# EasyEDA Pro project TeensySensorBoardV2.eprj, board PCB1
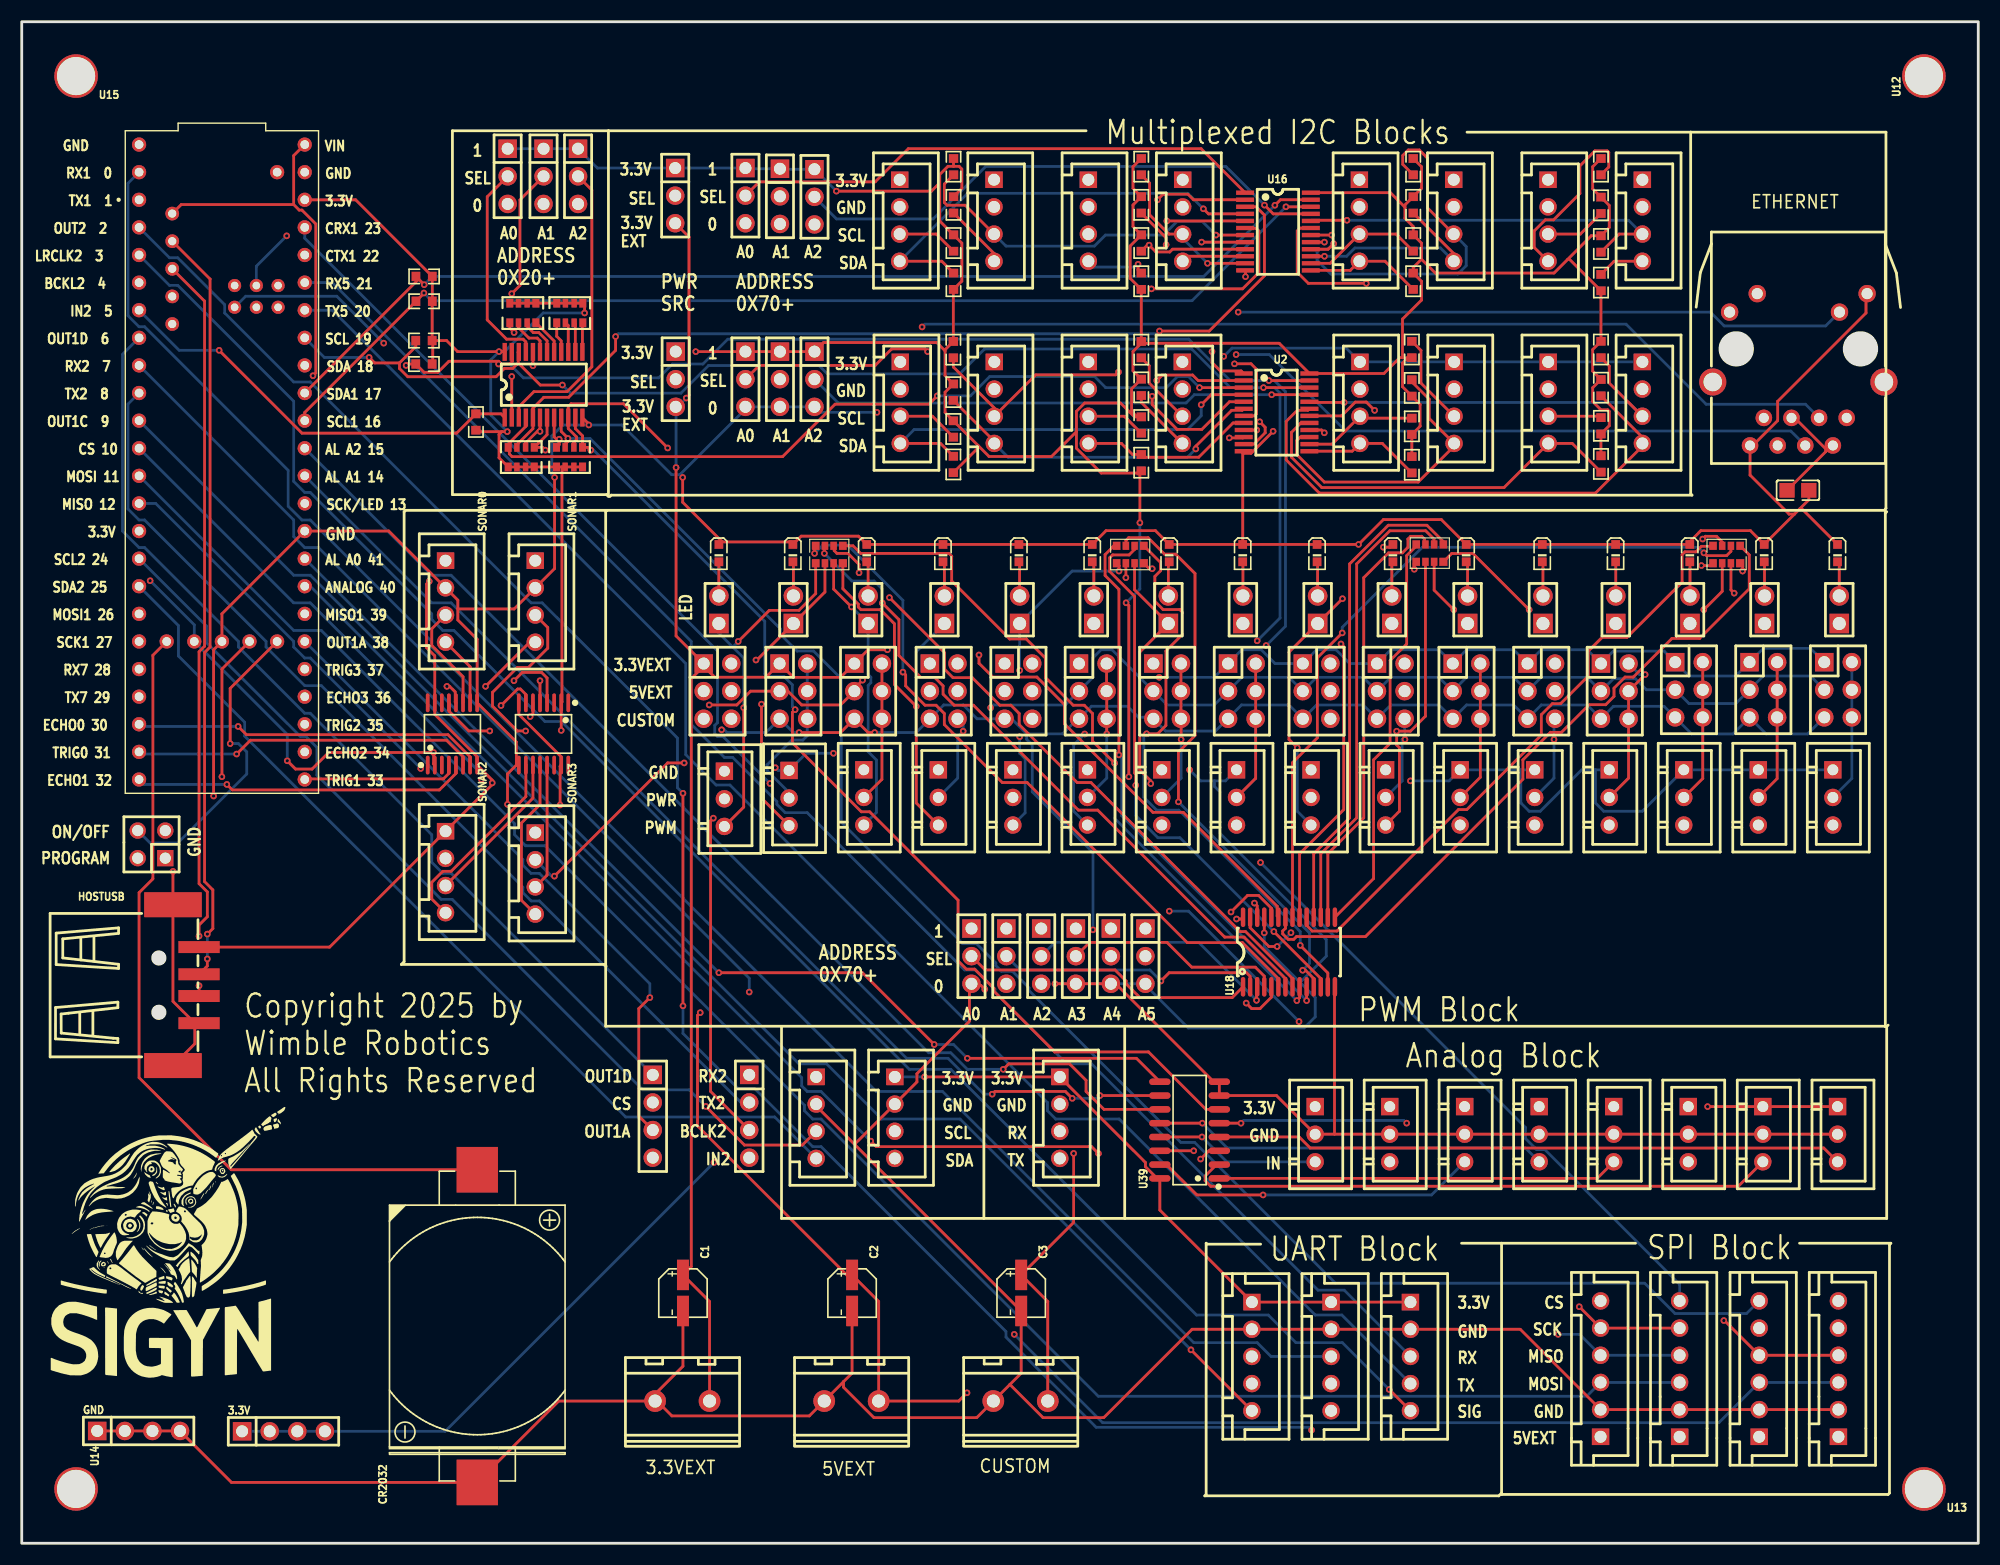
[diagram p8: board, top side]
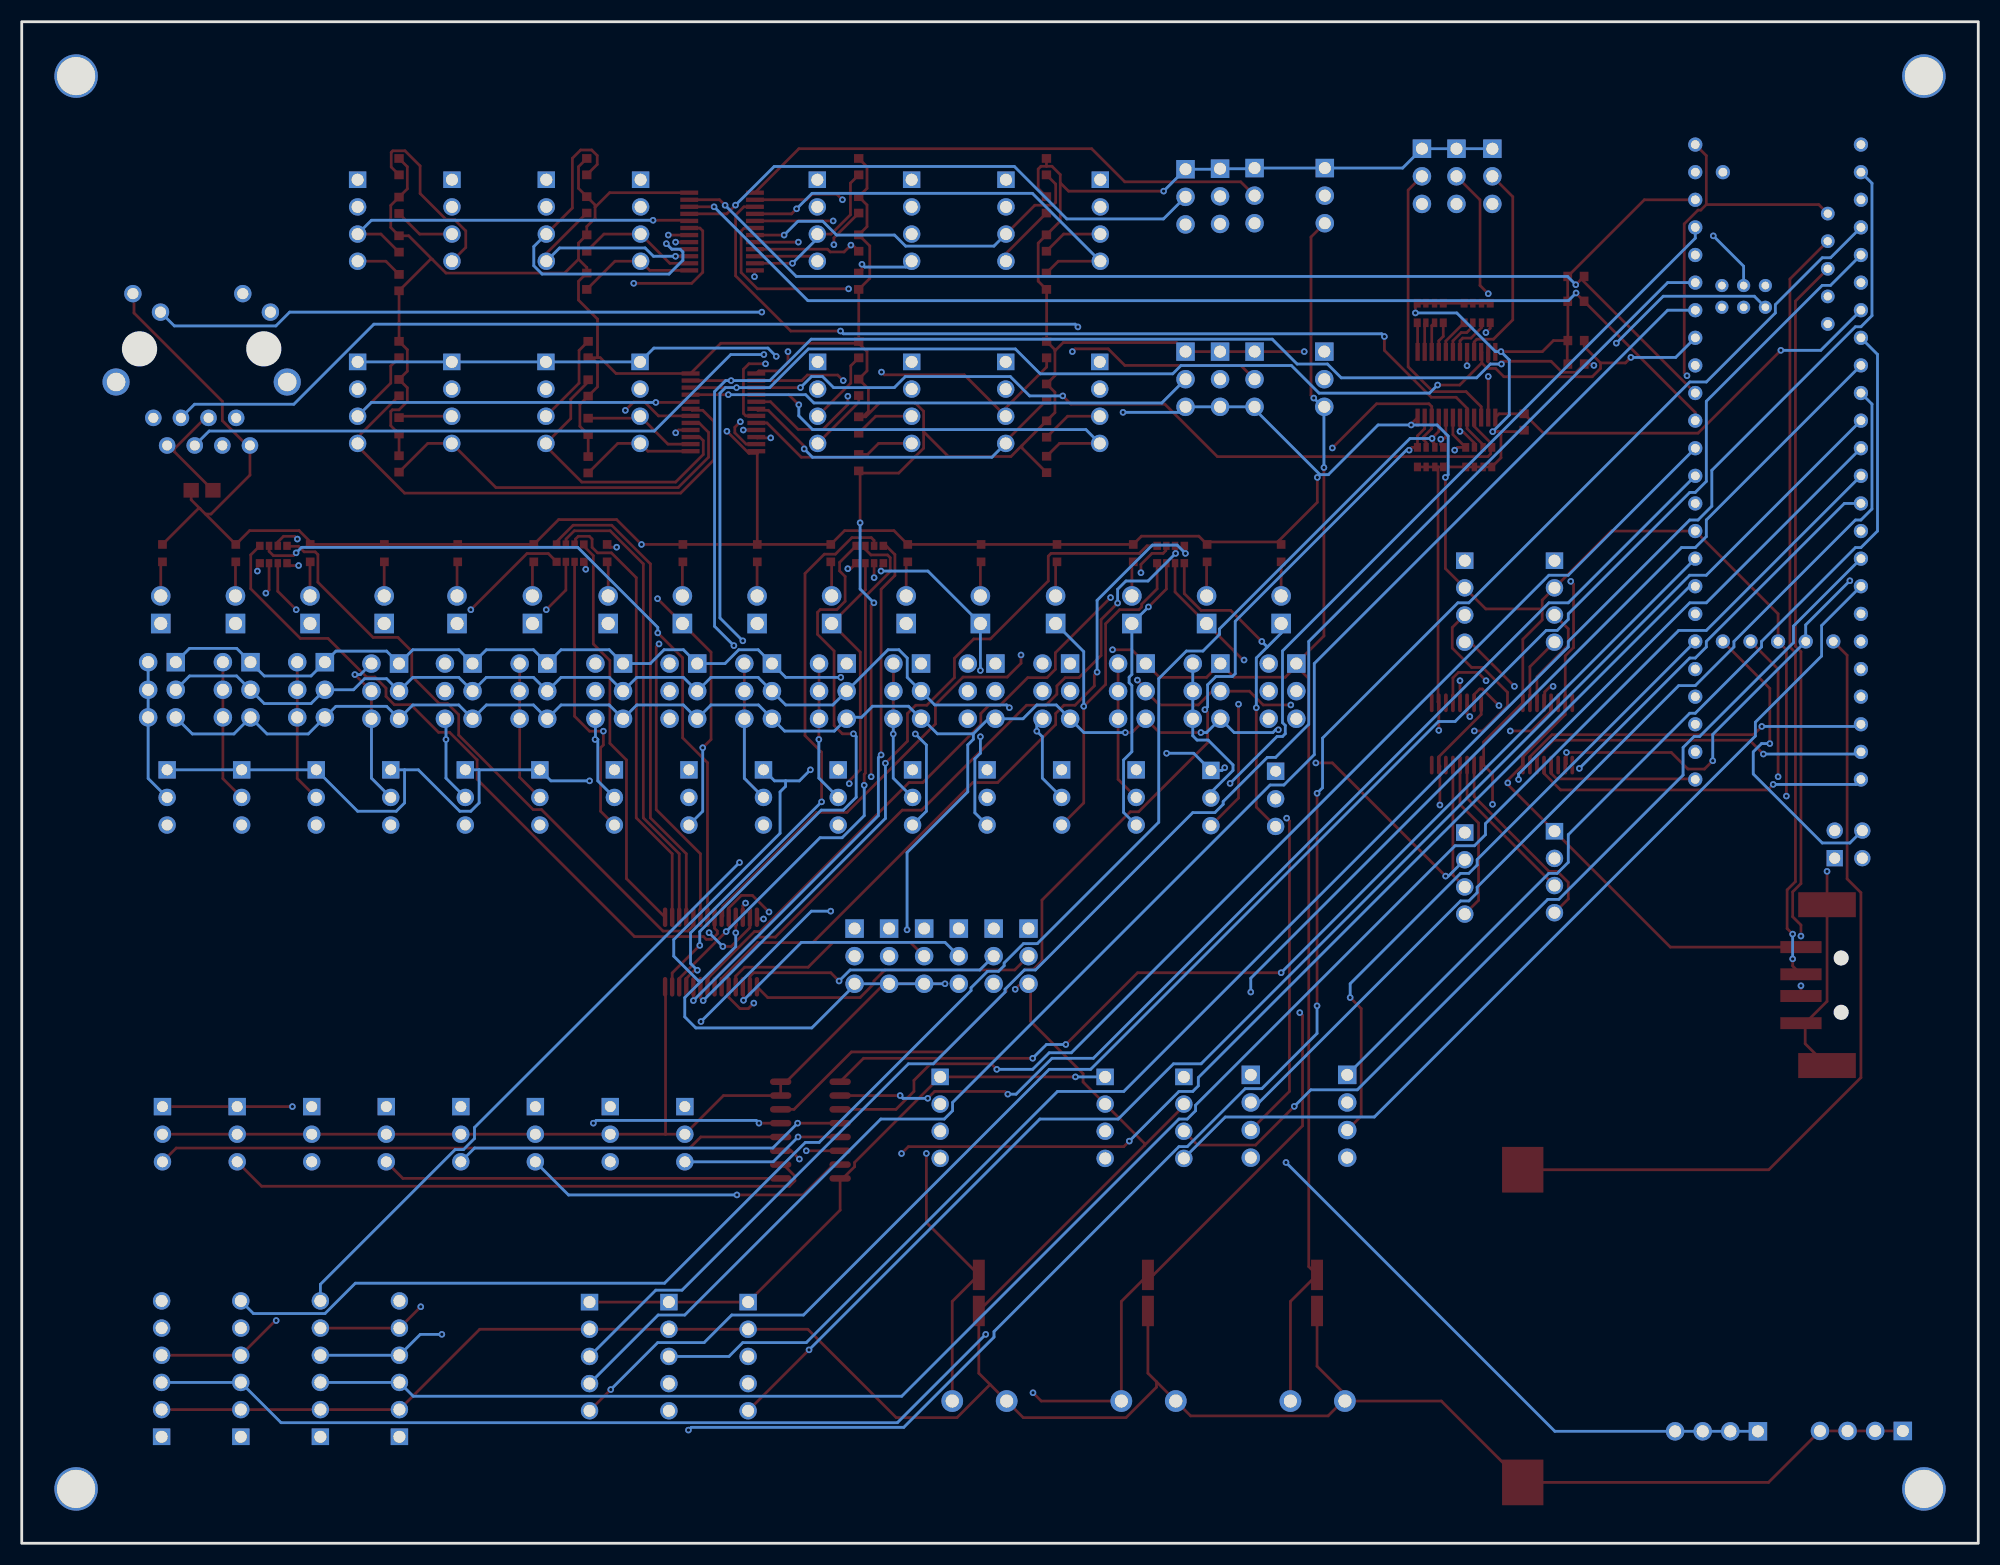
[diagram p9: board, bottom side, seen from below]

Outline 180 x 140 mm; copper layers: Top Layer, Inner1, Inner2, Bottom Layer. Coordinates in mm from the lower left corner of the outline.
Outline path: rectangle 0,140 180,0
Stack: Top Layer 0.035mm Outer layer thickness 1oz / Dielectric1 0.2104mm 7628 RC49% 8.6mil / Inner1 0.0152mm Inner layer thickness / Dielectric2 1.065mm 1.1mm H/HOZ Copper / Inner2 0.0152mm Inner layer thickness / Dielectric3 0.2104mm 7628 RC49% 8.6mil / Bottom Layer 0.035mm Outer layer thickness 1oz

## Design rules (mm)
template: Custom Config
spacing copperThickness1oz (default): track to track 0.102, other pairs 0.152 to 0.3
spacing copperThickness2oz: track to track 0.203, other pairs 0.152 to 0.3
track width copperThickness1oz (default): min 0.127, default 0.254, max 2.54
track width copperThickness2oz: min 0.203, default 0.254, max 2.54
track width trackWidth1: min 0.127, default 0.5, max 2.54
differential pair differentialPair (default): width min 0.127, default 0.254, max 2.54; gap min 0.152, default 0.152
via viaSize (default): diameter min 0.5, default 0.61, max 10; hole min 0.3, default 0.305, max 6.3
net class Power uses trackWidth1

## Placement (name value [footprint] x y rotation side)
3.3V  PZ254V-11-04P  [HDR-TH_4P-P2.54-V-M]  24.08 10.3 0 top
3.3VEXT  WJ127-5.0-2P  [CONN-TH_2P-P5.00_CPC3703CTR]  60.77 13.09 0 top
5VEXT  WJ127-5.0-2P  [CONN-TH_2P-P5.00_CPC3703CTR]  76.33 13.09 0 top
C1  10uF  [CAP-SMD_BD4.0-L4.3-W4.3-LS5.0-FD]  60.83 23.03 270 top
C2  10uF  [CAP-SMD_BD4.0-L4.3-W4.3-LS5.0-FD]  76.39 23.03 270 top
C3  10uF  [CAP-SMD_BD4.0-L4.3-W4.3-LS5.0-FD]  91.95 23.03 270 top
C4  100nF  [C0805]  163.41 96.89 0 top
CN10  ZX-XH2.54-4PZZ  [CONN-TH_4P-P2.50_4PIN]  95.5 39.16 270 top
CN11  ZX-XH2.54-4PZZ  [CONN-TH_4P-P2.50_4PIN]  73.09 39.16 270 top
CN12  ZX-XH2.54-4PZZ  [CONN-TH_4P-P2.50_4PIN]  80.32 39.16 270 top
CN14  ZX-XH2.54-4PZZ  [CONN-TH_4P-P2.50_4PIN]  80.82 104.95 270 top
CN15  ZX-XH2.54-4PZZ  [CONN-TH_4P-P2.50_4PIN]  89.47 104.95 270 top
CN16  ZX-XH2.54-4PZZ  [CONN-TH_4P-P2.50_4PIN]  98.12 104.95 270 top
CN17  ZX-XH2.54-4PZZ  [CONN-TH_4P-P2.50_4PIN]  106.78 104.95 270 top
CN18  ZX-XH2.54-4PZZ  [CONN-TH_4P-P2.50_4PIN]  123.11 104.95 270 top
CN19  ZX-XH2.54-4PZZ  [CONN-TH_4P-P2.50_4PIN]  131.78 104.95 270 top
CN20  ZX-XH2.54-4PZZ  [CONN-TH_4P-P2.50_4PIN]  140.44 104.95 270 top
CN21  ZX-XH2.54-4PZZ  [CONN-TH_4P-P2.50_4PIN]  149.1 104.95 270 top
CN56  ZX-XH2.54-3PZZ  [CONN-TH_3P-P2.54_2501S-3P]  167.05 37.64 270 top
CN57  ZX-XH2.54-3PZZ  [CONN-TH_3P-P2.54_2501S-3P]  160.18 37.64 270 top
CN58  ZX-XH2.54-3PZZ  [CONN-TH_3P-P2.54_2501S-3P]  153.32 37.64 270 top
CN59  ZX-XH2.54-3PZZ  [CONN-TH_3P-P2.54_2501S-3P]  146.46 37.64 270 top
CN60  ZX-XH2.54-3PZZ  [CONN-TH_3P-P2.54_2501S-3P]  139.6 37.64 270 top
CN61  ZX-XH2.54-3PZZ  [CONN-TH_3P-P2.54_2501S-3P]  132.75 37.64 270 top
CN62  ZX-XH2.54-3PZZ  [CONN-TH_3P-P2.54_2501S-3P]  125.86 37.64 270 top
CN63  ZX-XH2.54-3PZZ  [CONN-TH_3P-P2.54_2501S-3P]  118.99 37.64 270 top
CN64  ZX-XH2.54-4PZZ  [CONN-TH_4P-P2.50_4PIN]  80.77 121.71 270 top
CN65  ZX-XH2.54-4PZZ  [CONN-TH_4P-P2.50_4PIN]  89.45 121.71 270 top
CN66  ZX-XH2.54-4PZZ  [CONN-TH_4P-P2.50_4PIN]  98.13 121.71 270 top
CN67  ZX-XH2.54-4PZZ  [CONN-TH_4P-P2.50_4PIN]  106.81 121.71 270 top
CN68  ZX-XH2.54-4PZZ  [CONN-TH_4P-P2.50_4PIN]  123.06 121.71 270 top
CN69  ZX-XH2.54-4PZZ  [CONN-TH_4P-P2.50_4PIN]  131.74 121.71 270 top
CN70  ZX-XH2.54-4PZZ  [CONN-TH_4P-P2.50_4PIN]  140.42 121.71 270 top
CN71  ZX-XH2.54-4PZZ  [CONN-TH_4P-P2.50_4PIN]  149.1 121.71 270 top
CN72  ZX-XH2.54-3PZZ  [CONN-TH_3P-P2.54_2501S-3P]  64.64 68.5 270 top
CN73  ZX-XH2.54-3PZZ  [CONN-TH_3P-P2.54_2501S-3P]  70.6 68.57 270 top
CN74  ZX-XH2.54-3PZZ  [CONN-TH_3P-P2.54_2501S-3P]  77.47 68.63 270 top
CN75  ZX-XH2.54-3PZZ  [CONN-TH_3P-P2.54_2501S-3P]  84.33 68.63 270 top
CN76  ZX-XH2.54-3PZZ  [CONN-TH_3P-P2.54_2501S-3P]  91.19 68.63 270 top
CN77  ZX-XH2.54-3PZZ  [CONN-TH_3P-P2.54_2501S-3P]  98.04 68.63 270 top
CN78  ZX-XH2.54-3PZZ  [CONN-TH_3P-P2.54_2501S-3P]  104.89 68.63 270 top
CN79  ZX-XH2.54-3PZZ  [CONN-TH_3P-P2.54_2501S-3P]  111.76 68.63 270 top
CN80  ZX-XH2.54-3PZZ  [CONN-TH_3P-P2.54_2501S-3P]  118.62 68.63 270 top
CN81  ZX-XH2.54-3PZZ  [CONN-TH_3P-P2.54_2501S-3P]  125.48 68.63 270 top
CN82  ZX-XH2.54-3PZZ  [CONN-TH_3P-P2.54_2501S-3P]  132.33 68.63 270 top
CN83  ZX-XH2.54-3PZZ  [CONN-TH_3P-P2.54_2501S-3P]  139.19 68.63 270 top
CN84  ZX-XH2.54-3PZZ  [CONN-TH_3P-P2.54_2501S-3P]  146.05 68.63 270 top
CN85  ZX-XH2.54-3PZZ  [CONN-TH_3P-P2.54_2501S-3P]  152.91 68.63 270 top
CN86  ZX-XH2.54-3PZZ  [CONN-TH_3P-P2.54_2501S-3P]  159.77 68.63 270 top
CN87  ZX-XH2.54-3PZZ  [CONN-TH_3P-P2.54_2501S-3P]  166.62 68.63 270 top
CR2032  CR2032-BS-6  [BAT-TH_CR2032-BS-6-1]  41.91 19.99 90 top
CUSTOM  WJ127-5.0-2P  [CONN-TH_2P-P5.00_CPC3703CTR]  91.89 13.09 0 top
ETHERNET  J1B1211CCD  [RJ45-TH_J1B1211CCD]  163.45 108 180 top
F1  220Ω  [RES-ARRAY-SMD_0603-8P-L3.2-W1.6-TL]  74.29 90.98 90 top
F2  220Ω  [RES-ARRAY-SMD_0603-8P-L3.2-W1.6-TL]  101.98 90.98 90 top
F3  220Ω  [RES-ARRAY-SMD_0603-8P-L3.2-W1.6-TL]  129.54 91.11 90 top
F4  220Ω  [RES-ARRAY-SMD_0603-8P-L3.2-W1.6-TL]  156.84 90.98 90 top
GND  PZ254V-11-04P  [HDR-TH_4P-P2.54-V-M]  10.75 10.33 0 top
H2  PH-00013  [HDR-TH_2P-P2.54-V-M-R2-C1-S2.54]  70.99 85.9 0 top
H3  PH-00013  [HDR-TH_2P-P2.54-V-M-R2-C1-S2.54]  64.14 85.9 0 top
H4  PH-00013  [HDR-TH_2P-P2.54-V-M-R2-C1-S2.54]  77.87 85.9 0 top
H5  PH-00013  [HDR-TH_2P-P2.54-V-M-R2-C1-S2.54]  84.88 85.9 0 top
H6  PH-00013  [HDR-TH_2P-P2.54-V-M-R2-C1-S2.54]  91.81 85.9 0 top
H7  PH-00013  [HDR-TH_2P-P2.54-V-M-R2-C1-S2.54]  98.63 85.9 0 top
H8  PH-00013  [HDR-TH_2P-P2.54-V-M-R2-C1-S2.54]  105.49 85.9 0 top
H9  PH-00013  [HDR-TH_2P-P2.54-V-M-R2-C1-S2.54]  112.35 85.9 0 top
H10  PH-00013  [HDR-TH_2P-P2.54-V-M-R2-C1-S2.54]  119.22 85.9 0 top
H11  PH-00013  [HDR-TH_2P-P2.54-V-M-R2-C1-S2.54]  126.05 85.9 0 top
H12  PH-00013  [HDR-TH_2P-P2.54-V-M-R2-C1-S2.54]  133.02 85.9 0 top
H13  PH-00013  [HDR-TH_2P-P2.54-V-M-R2-C1-S2.54]  139.95 85.9 0 top
H14  PH-00013  [HDR-TH_2P-P2.54-V-M-R2-C1-S2.54]  146.65 85.9 0 top
H15  PH-00013  [HDR-TH_2P-P2.54-V-M-R2-C1-S2.54]  153.48 85.9 0 top
H16  PH-00013  [HDR-TH_2P-P2.54-V-M-R2-C1-S2.54]  160.34 85.9 0 top
H17  PH-00013  [HDR-TH_2P-P2.54-V-M-R2-C1-S2.54]  167.21 85.9 0 top
H18  HX PZ2.54-2x2P ZZ  [HDR-TH_HX-PZ2.54-2X2P-ZZ]  11.94 64.31 90 top
H19  PZ254V-11-04P  [HDR-TH_4P-P2.54-V-M]  66.93 39.29 270 top
H20  PZ254V-11-04P  [HDR-TH_4P-P2.54-V-M]  58.06 39.29 270 top
HOSTUSB  BX-TYPE-A-MWT4P  [USB-A-SMD_BX-TYPE-A-MWT4P]  15.11 51.35 270 top
I2C1-A0  PZ254V-11-03P  [HDR-TH_3P-P2.54-V-M]  66.58 107.11 270 top
I2C1-A1  PZ254V-11-03P  [HDR-TH_3P-P2.54-V-M]  69.75 107.11 270 top
I2C1-A2  PZ254V-11-03P  [HDR-TH_3P-P2.54-V-M]  72.93 107.11 270 top
I2C1-PWR  PZ254V-11-03P  [HDR-TH_3P-P2.54-V-M]  60.17 107.11 270 top
I2C2-A0  PZ254V-11-03P  [HDR-TH_3P-P2.54-V-M]  66.58 124 270 top
I2C2-A1  PZ254V-11-03P  [HDR-TH_3P-P2.54-V-M]  69.75 123.93 270 top
I2C2-A2  PZ254V-11-03P  [HDR-TH_3P-P2.54-V-M]  72.93 123.89 270 top
I2C2-PWR  PZ254V-11-03P  [HDR-TH_3P-P2.54-V-M]  60.12 124 270 top
I2CX-A0  PZ254V-11-03P  [HDR-TH_3P-P2.54-V-M]  44.7 125.78 270 top
I2CX-A1  PZ254V-11-03P  [HDR-TH_3P-P2.54-V-M]  48.01 125.78 270 top
I2CX-A2  PZ254V-11-03P  [HDR-TH_3P-P2.54-V-M]  51.18 125.78 270 top
LED1  19-219/GHC-YR2T1B5Y/3T  [LED-SMD_L1.6-W0.8_19-219-GHC-YR2T1B5Y-3T]  70.94 91.11 270 top
LED2  19-219/GHC-YR2T1B5Y/3T  [LED-SMD_L1.6-W0.8_19-219-GHC-YR2T1B5Y-3T]  64.14 91.11 270 top
LED3  19-219/GHC-YR2T1B5Y/3T  [LED-SMD_L1.6-W0.8_19-219-GHC-YR2T1B5Y-3T]  77.74 91.11 270 top
LED4  19-219/GHC-YR2T1B5Y/3T  [LED-SMD_L1.6-W0.8_19-219-GHC-YR2T1B5Y-3T]  84.76 91.11 270 top
LED5  19-219/GHC-YR2T1B5Y/3T  [LED-SMD_L1.6-W0.8_19-219-GHC-YR2T1B5Y-3T]  91.74 91.11 270 top
LED6  19-219/GHC-YR2T1B5Y/3T  [LED-SMD_L1.6-W0.8_19-219-GHC-YR2T1B5Y-3T]  98.49 91.11 270 top
LED7  19-219/GHC-YR2T1B5Y/3T  [LED-SMD_L1.6-W0.8_19-219-GHC-YR2T1B5Y-3T]  105.57 91.11 270 top
LED8  19-219/GHC-YR2T1B5Y/3T  [LED-SMD_L1.6-W0.8_19-219-GHC-YR2T1B5Y-3T]  112.33 91.11 270 top
LED9  19-219/GHC-YR2T1B5Y/3T  [LED-SMD_L1.6-W0.8_19-219-GHC-YR2T1B5Y-3T]  119.17 91.11 270 top
LED10  19-219/GHC-YR2T1B5Y/3T  [LED-SMD_L1.6-W0.8_19-219-GHC-YR2T1B5Y-3T]  126.14 91.11 270 top
LED11  19-219/GHC-YR2T1B5Y/3T  [LED-SMD_L1.6-W0.8_19-219-GHC-YR2T1B5Y-3T]  132.89 91.11 270 top
LED12  19-219/GHC-YR2T1B5Y/3T  [LED-SMD_L1.6-W0.8_19-219-GHC-YR2T1B5Y-3T]  139.89 91.11 270 top
LED13  19-219/GHC-YR2T1B5Y/3T  [LED-SMD_L1.6-W0.8_19-219-GHC-YR2T1B5Y-3T]  146.64 91.11 270 top
LED14  19-219/GHC-YR2T1B5Y/3T  [LED-SMD_L1.6-W0.8_19-219-GHC-YR2T1B5Y-3T]  153.46 91.11 270 top
LED15  19-219/GHC-YR2T1B5Y/3T  [LED-SMD_L1.6-W0.8_19-219-GHC-YR2T1B5Y-3T]  160.31 91.11 270 top
LED16  19-219/GHC-YR2T1B5Y/3T  [LED-SMD_L1.6-W0.8_19-219-GHC-YR2T1B5Y-3T]  167.05 91.11 270 top
PWM-A0  PZ254V-11-03P  [HDR-TH_3P-P2.54-V-M]  87.38 54.02 270 top
PWM-A1  PZ254V-11-03P  [HDR-TH_3P-P2.54-V-M]  90.58 54.02 270 top
PWM-A2  PZ254V-11-03P  [HDR-TH_3P-P2.54-V-M]  93.79 54.02 270 top
PWM-A3  PZ254V-11-03P  [HDR-TH_3P-P2.54-V-M]  96.98 54.02 270 top
PWM-A4  PZ254V-11-03P  [HDR-TH_3P-P2.54-V-M]  100.2 54.02 270 top
PWM-A5  PZ254V-11-03P  [HDR-TH_3P-P2.54-V-M]  103.38 54.02 270 top
R1  3kΩ  [R0603]  85.71 99.26 90 top
R2  3kΩ  [R0603]  85.71 102.53 270 top
R3  3kΩ  [R0603]  85.71 105.92 270 top
R4  3kΩ  [R0603]  85.71 109.83 270 top
R5  3kΩ  [R0603]  103 99.43 90 top
R6  3kΩ  [R0603]  103 102.89 270 top
R7  3kΩ  [R0603]  103 106.36 270 top
R8  3kΩ  [R0603]  103 109.83 270 top
R9  3kΩ  [R0603]  145.29 109.84 90 top
R10  3kΩ  [R0603]  145.29 106.33 90 top
R11  3kΩ  [R0603]  145.29 102.82 270 top
R12  3kΩ  [R0603]  145.29 99.31 90 top
R13  3kΩ  [R0603]  127.89 109.84 270 top
R14  3kΩ  [R0603]  127.89 106.31 270 top
R15  3kΩ  [R0603]  127.89 102.77 270 top
R16  3kΩ  [R0603]  127.89 99.24 90 top
R17  3kΩ  [R0603]  37 110.66 0 top
R18  3kΩ  [R0603]  37 108.5 0 top
R35  3kΩ  [R0603]  85.72 116.12 90 top
R36  3kΩ  [R0603]  85.72 119.64 270 top
R37  3kΩ  [R0603]  85.72 123.15 270 top
R38  3kΩ  [R0603]  85.72 126.66 270 top
R39  3kΩ  [R0603]  103 116.12 90 top
R40  3kΩ  [R0603]  103 119.64 270 top
R41  3kΩ  [R0603]  103 123.15 270 top
R42  3kΩ  [R0603]  145.29 119.55 90 top
R43  3kΩ  [R0603]  145.29 116 270 top
R44  3kΩ  [R0603]  145.29 123.11 90 top
R45  3kΩ  [R0603]  145.29 126.66 90 top
R46  3kΩ  [R0603]  128.02 126.66 90 top
R47  3kΩ  [R0603]  128.02 123.15 90 top
R48  3kΩ  [R0603]  128.02 119.64 90 top
R49  3kΩ  [R0603]  128.02 116.12 90 top
R50  3kΩ  [R0603]  103 126.66 270 top
R51  3kΩ  [R0603]  41.78 103.17 270 top
R52  3kΩ  [R0603]  37.02 114.28 0 top
R53  3kΩ  [R0603]  37.02 116.56 0 top
RN1  10kΩ  [RES-ARRAY-SMD_0603-8P-L3.2-W1.6-BL]  45.95 99.93 0 top
RN2  10kΩ  [RES-ARRAY-SMD_0603-8P-L3.2-W1.6-BL]  50.39 99.93 0 top
RN3  10kΩ  [RES-ARRAY-SMD_0603-8P-L3.2-W1.6-BL]  50.42 113.2 180 top
RN4  10kΩ  [RES-ARRAY-SMD_0603-8P-L3.2-W1.6-BL]  46.1 113.2 180 top
SONAR0  ZX-XH2.54-4PZZ  [CONN-TH_4P-P2.50_4PIN]  38.99 86.66 270 top
SONAR1  ZX-XH2.54-4PZZ  [CONN-TH_4P-P2.50_4PIN]  47.24 86.66 270 top
SONAR2  ZX-XH2.54-4PZZ  [CONN-TH_4P-P2.50_4PIN]  38.99 61.77 270 top
SONAR3  ZX-XH2.54-4PZZ  [CONN-TH_4P-P2.50_4PIN]  47.24 61.64 270 top
U2  TCA9548APWR  [TSSOP-24_L7.8-W4.4-P0.65-LS6.4-BL]  115.44 104.06 270 top
U4  ZX-XH2.54-6PZZ  [CONN-TH_6P-P2.50_ZX-XH2.54-6PZZ]  152.53 16.05 270 top
U5  ZX-XH2.54-5PZZ  [CONN-TH_5P-P2.50_ZX-XH2.54-5PZZ]  113.17 17.19 270 top
U6  ZX-XH2.54-5PZZ  [CONN-TH_5P-P2.50_ZX-XH2.54-5PZZ]  120.46 17.19 270 top
U8  ZX-XH2.54-6PZZ  [CONN-TH_6P-P2.50_ZX-XH2.54-6PZZ]  145.25 16.05 270 top
U12  -  [3.5mm_Hole]  175 135 90 top
U13  -  [3.5mm_Hole]  175 5 180 top
U14  -  [3.5mm_Hole]  5 5 270 top
U15  -  [3.5mm_Hole]  5 135 180 top
U16  TCA9548APWR  [TSSOP-24_L7.8-W4.4-P0.65-LS6.4-BL]  115.57 120.7 270 top
U17  TCA9535PWR  [TSSOP-24_L7.8-W4.4-P0.65-LS6.4-BL]  48.01 106.6 0 top
U18  PCA9685PW,118  [TSSOP-28_L9.7-W4.4-P0.65-LS6.4-TL]  116.59 54.4 90 top
U19  BX-PZ2.54-2-3PZZ  [HDR-TH_6P-P2.54-V-M-R2-C3-S2.54]  64.01 78.41 270 top
U20  BX-PZ2.54-2-3PZZ  [HDR-TH_6P-P2.54-V-M-R2-C3-S2.54]  70.99 78.41 270 top
U21  BX-PZ2.54-2-3PZZ  [HDR-TH_6P-P2.54-V-M-R2-C3-S2.54]  77.87 78.41 270 top
U22  BX-PZ2.54-2-3PZZ  [HDR-TH_6P-P2.54-V-M-R2-C3-S2.54]  84.82 78.41 270 top
U23  BX-PZ2.54-2-3PZZ  [HDR-TH_6P-P2.54-V-M-R2-C3-S2.54]  91.69 78.41 270 top
U24  BX-PZ2.54-2-3PZZ  [HDR-TH_6P-P2.54-V-M-R2-C3-S2.54]  98.54 78.41 270 top
U25  BX-PZ2.54-2-3PZZ  [HDR-TH_6P-P2.54-V-M-R2-C3-S2.54]  105.38 78.41 270 top
U26  BX-PZ2.54-2-3PZZ  [HDR-TH_6P-P2.54-V-M-R2-C3-S2.54]  112.25 78.41 270 top
U27  BX-PZ2.54-2-3PZZ  [HDR-TH_6P-P2.54-V-M-R2-C3-S2.54]  119.13 78.41 270 top
U28  BX-PZ2.54-2-3PZZ  [HDR-TH_6P-P2.54-V-M-R2-C3-S2.54]  125.95 78.41 270 top
U29  BX-PZ2.54-2-3PZZ  [HDR-TH_6P-P2.54-V-M-R2-C3-S2.54]  132.92 78.41 270 top
U30  BX-PZ2.54-2-3PZZ  [HDR-TH_6P-P2.54-V-M-R2-C3-S2.54]  139.79 78.41 270 top
U31  BX-PZ2.54-2-3PZZ  [HDR-TH_6P-P2.54-V-M-R2-C3-S2.54]  146.56 78.41 270 top
U32  BX-PZ2.54-2-3PZZ  [HDR-TH_6P-P2.54-V-M-R2-C3-S2.54]  153.38 78.53 270 top
U33  BX-PZ2.54-2-3PZZ  [HDR-TH_6P-P2.54-V-M-R2-C3-S2.54]  160.23 78.53 270 top
U34  BX-PZ2.54-2-3PZZ  [HDR-TH_6P-P2.54-V-M-R2-C3-S2.54]  167.1 78.53 270 top
U35  TXB0106PWR  [TSSOP-16_L5.0-W4.4-P0.65-LS6.4-BL]  39.62 74.47 0 top
U36  TXB0106PWR  [TSSOP-16_L5.0-W4.4-P0.65-LS6.4-BL]  48.01 74.47 180 top
U37  Teensy 4.1  [MODULE_DEV-16771]  18.42 99.49 270 top
U39  CD74HC4051M96  [SOIC-16_L9.9-W3.9-P1.27-LS6.0-BL]  107.44 38.02 90 top
U40  ZX-XH2.54-6PZZ  [CONN-TH_6P-P2.50_ZX-XH2.54-6PZZ]  167.13 16.05 270 top
U41  ZX-XH2.54-6PZZ  [CONN-TH_6P-P2.50_ZX-XH2.54-6PZZ]  159.84 16.05 270 top
U42  ZX-XH2.54-5PZZ  [CONN-TH_5P-P2.50_ZX-XH2.54-5PZZ]  127.76 17.19 270 top

## Footprints (pads in the part's own frame, mm; a bottom-side part is the same pattern mirrored in y, then rotated)
3.5mm_Hole
  round 4 hole 3.5: 3(0,0)
BAT-TH_CR2032-BS-6-1
  rect 4.2x3.8 smd: 1(14.385,0) 2(-14.385,0)
C0805
  rect 1.41x1.35 smd: 1(-1,0) 2(1,0)
CAP-SMD_BD4.0-L4.3-W4.3-LS5.0-FD
  rect 2.8x1.1 smd: 1(-1.661,0) 2(1.661,0)
CONN-TH_2P-P5.00_CPC3703CTR
  round 2 hole 1.2: 1(-2.505,0) 2(2.505,0)
CONN-TH_3P-P2.54_2501S-3P
  rect 1.6x1.6 hole 1: 1(-2.54,0)
  round 1.6 hole 1: 2(0,0) 3(2.54,0)
CONN-TH_4P-P2.50_4PIN
  rect 1.524x1.6 hole 1.1: 1(-3.75,0)
  round 1.6 hole 1.1: 2(-1.25,0) 3(1.25,0) 4(3.75,0)
CONN-TH_5P-P2.50_ZX-XH2.54-5PZZ
  rect 1.524x1.6 hole 1.1: 1(-5,0)
  round 1.6 hole 1.1: 2(-2.5,0) 3(0,0) 4(2.5,0) 5(5,0)
CONN-TH_6P-P2.50_ZX-XH2.54-6PZZ
  rect 1.524x1.6 hole 1.1: 1(6.25,0)
  round 1.6 hole 1.1: 2(3.75,0) 3(1.25,0) 4(-1.25,0) 5(-3.75,0) 6(-6.25,0)
HDR-TH_2P-P2.54-V-M-R2-C1-S2.54
  rect 1.8x1.8 hole 1.2: 1(0,-1.27)
  round 1.8 hole 1.2: 2(0,1.27)
HDR-TH_3P-P2.54-V-M
  rect 1.7x1.7 hole 1.1: 1(-2.54,0)
  round 1.7 hole 1.1: 2(0,0) 3(2.54,0)
HDR-TH_4P-P2.54-V-M
  rect 1.7x1.7 hole 1.1: 1(-3.81,0)
  round 1.7 hole 1.1: 2(-1.27,0) 3(1.27,0) 4(3.81,0)
HDR-TH_6P-P2.54-V-M-R2-C3-S2.54
  rect 1.7x1.7 hole 1.1: 1(-2.54,-1.27)
  round 1.7 hole 1.1: 2(-2.54,1.27) 3(0,-1.27) 4(0,1.27) 5(2.54,-1.27) 6(2.54,1.27)
HDR-TH_HX-PZ2.54-2X2P-ZZ
  rect 1.5x1.5 hole 1.02: 1(-1.27,-1.27)
  round 1.5 hole 1.02: 2(-1.27,1.27) 3(1.27,-1.27) 4(1.27,1.27)
LED-SMD_L1.6-W0.8_19-219-GHC-YR2T1B5Y-3T
  rect 0.8x0.8 smd: 1(0.799,0) 2(-0.799,0)
MODULE_DEV-16771
  round 1.308 hole 0.8: 0(-26.67,-7.62) 1(-24.13,-7.62) 2(-21.59,-7.62) 3(-19.05,-7.62) 3.3V_1(6.35,-7.62) 3.3V_2(-24.13,7.62) 3.3V_3(16.51,-2.54) 4(-16.51,-7.62) 5(-13.97,-7.62) 6(-11.43,-7.62) 7(-8.89,-7.62) 8(-6.35,-7.62) 9(-3.81,-7.62) 10(-1.27,-7.62) 11(1.27,-7.62) 12(3.81,-7.62) 13(3.81,7.62) 14(1.27,7.62) 15(-1.27,7.62) 16(-3.81,7.62) 17(-6.35,7.62) 18(-8.89,7.62) 19(-11.43,7.62) 20(-13.97,7.62) 21(-16.51,7.62) 22(-19.05,7.62) 23(-21.59,7.62) 24(8.89,-7.62) 25(11.43,-7.62) 26(13.97,-7.62) 27(16.51,-7.62) 28(19.05,-7.62) 29(21.59,-7.62) 30(24.13,-7.62) 31(26.67,-7.62) 32(29.21,-7.62) 33(29.21,7.62) 34(26.67,7.62) 35(24.13,7.62) 36(21.59,7.62) 37(19.05,7.62) 38(16.51,7.62) 39(13.97,7.62) 40(11.43,7.62) 41(8.89,7.62) GND1(-29.21,-7.62) GND2(6.35,7.62) GND3(-26.67,7.62) GND4(16.51,0) ON/OFF(16.51,5.08) PROGRAM(16.51,2.54) VBAT(16.51,-5.08) VIN(-29.21,7.62) VUSB(-26.67,5.08)
  round 1.258 hole 0.75: 5V(-22.86,-4.57) D+(-17.78,-4.57) D-(-20.32,-4.57) USB_GND1(-15.24,-4.57) USB_GND2(-12.7,-4.57)
  round 1.208 hole 0.7: GND5(-14.24,3.17) LED(-16.24,3.17) R+(-16.24,5.17) R-(-14.24,5.17) T+(-14.24,1.17) T-(-16.24,1.17)
R0603
  rect 0.806x0.864 smd: 1(-0.753,0) 2(0.753,0)
RES-ARRAY-SMD_0603-8P-L3.2-W1.6-BL
  rect 0.65x0.8 smd: 1(-1.2,-0.9) 4(1.2,-0.9) 5(1.2,0.9) 8(-1.2,0.9)
  rect 0.5x0.8 smd: 2(-0.4,-0.9) 3(0.4,-0.9) 6(0.4,0.9) 7(-0.4,0.9)
RES-ARRAY-SMD_0603-8P-L3.2-W1.6-TL
  rect 0.75x0.7 smd: 1(-0.8,1.25) 5(0.8,-1.25) 8(0.8,1.25)
  rect 0.75x0.6 smd: 2(-0.8,0.4) 3(-0.8,-0.4) 6(0.8,-0.4) 7(0.8,0.4)
  rect 0.75x0.75 smd: 4(-0.8,-1.25)
RJ45-TH_J1B1211CCD
  round 1.524 hole 0.914: 1(-4.445,4.445) 2(-3.175,6.985) 3(-1.905,4.445) 4(-0.635,6.985) 5(0.635,4.445) 6(1.905,6.985) 7(3.175,4.445) 8(4.445,6.985)
  round 1.6 hole 1.02: 9(-6.325,-6.985) 10(-3.785,-5.285) 11(3.785,-6.985) 12(6.325,-5.285)
  round 2.5 hole 1.7: 13(-7.875,1.145) 14(7.875,1.145)
SOIC-16_L9.9-W3.9-P1.27-LS6.0-BL
  oval 0.602x1.971 smd: 1(-4.445,-2.736) 2(-3.175,-2.736) 3(-1.905,-2.736) 4(-0.635,-2.736) 5(0.635,-2.736) 6(1.905,-2.736) 7(3.175,-2.736) 8(4.445,-2.736) 9(4.445,2.736) 10(3.175,2.736) 11(1.905,2.736) 12(0.635,2.736) 13(-0.635,2.736) 14(-1.905,2.736) 15(-3.175,2.736) 16(-4.445,2.736)
TSSOP-16_L5.0-W4.4-P0.65-LS6.4-BL
  oval 0.343x1.732 smd: 1(-2.275,-2.866) 2(-1.625,-2.866) 3(-0.975,-2.866) 4(-0.325,-2.866) 5(0.325,-2.866) 6(0.975,-2.866) 7(1.625,-2.866) 8(2.275,-2.866) 9(2.275,2.866) 10(1.625,2.866) 11(0.975,2.866) 12(0.325,2.866) 13(-0.325,2.866) 14(-0.975,2.866) 15(-1.625,2.866) 16(-2.275,2.866)
TSSOP-24_L7.8-W4.4-P0.65-LS6.4-BL
  rect 0.4x1.65 smd: 1(-3.575,-3.022) 2(-2.925,-3.022) 3(-2.275,-3.022) 4(-1.625,-3.022) 5(-0.975,-3.022) 6(-0.325,-3.022) 7(0.325,-3.022) 8(0.975,-3.022) 9(1.625,-3.022) 10(2.275,-3.022) 11(2.925,-3.022) 12(3.575,-3.022) 13(3.575,3.022) 14(2.925,3.022) 15(2.275,3.022) 16(1.625,3.022) 17(0.975,3.022) 18(0.325,3.022) 19(-0.325,3.022) 20(-0.975,3.022) 21(-1.625,3.022) 22(-2.275,3.022) 23(-2.925,3.022) 24(-3.575,3.022)
TSSOP-28_L9.7-W4.4-P0.65-LS6.4-TL
  oval 1.804x0.406 smd: 1(-3.2,4.225) 2(-3.2,3.575) 3(-3.2,2.925) 4(-3.2,2.275) 5(-3.2,1.625) 6(-3.2,0.975) 7(-3.2,0.325) 8(-3.2,-0.325) 9(-3.2,-0.975) 10(-3.2,-1.625) 11(-3.2,-2.275) 12(-3.2,-2.925) 13(-3.2,-3.575) 14(-3.2,-4.225) 15(3.2,-4.225) 16(3.2,-3.575) 17(3.2,-2.925) 18(3.2,-2.275) 19(3.2,-1.625) 20(3.2,-0.975) 21(3.2,-0.325) 22(3.2,0.325) 23(3.2,0.975) 24(3.2,1.625) 25(3.2,2.275) 26(3.2,2.925) 27(3.2,3.575) 28(3.2,4.225)
USB-A-SMD_BX-TYPE-A-MWT4P
  rect 1.1x3.8 smd: 1(-3.5,1.2) 2(-1,1.2) 3(1,1.2) 4(3.5,1.2)
  rect 2.3x5.3 smd: 5(-7.4,-1.2) 6(7.4,-1.2)

## Nets
As in the schematic, except:
3.3V: 3.3V.1 3.3V.2 3.3V.3 3.3V.4 CN10.1 CN11.1 CN12.1 CN56.1 CN57.1 CN58.1 CN59.1 CN60.1 CN61.1 CN62.1 CN63.1 I2C1-A0.1 I2C1-A1.1 I2C1-A2.1 I2C1-PWR.1 I2C2-A0.1 I2C2-A1.1 I2C2-A2.1 I2C2-PWR.1 I2CX-A0.1 I2CX-A1.1 I2CX-A2.1 PWM-A0.1 PWM-A1.1 PWM-A2.1 PWM-A3.1 PWM-A4.1 PWM-A5.1 R1.1 R2.1 R3.1 R4.1 R5.1 R6.1 R7.1 R8.1 R9.2 R10.2 R11.2 R12.2 R13.2 R14.2 R15.2 R16.2 R17.2 R18.2 R35.1 R36.1 R37.1 R38.1 R39.1 R40.1 R41.1 R42.2 R43.2 R44.2 R45.2 R46.2 R47.2 R48.2 R49.2 R50.1 R51.2 R52.2 R53.2 RN1.1 RN1.2 RN1.3 RN1.4 RN2.1 RN2.2 RN2.3 RN2.4 RN3.1 RN3.2 RN3.3 RN3.4 RN4.1 RN4.2 RN4.3 RN4.4 U2.24 U5.1 U6.1 U16.24 U17.24 U18.28 U35.2 U36.2 U37.3.3V_1 U37.3.3V_2 U37.3.3V_3 U39.16 U42.1
5VEXT: 5VEXT.2 C2.1 HOSTUSB.1 SONAR0.1 SONAR1.1 SONAR2.1 SONAR3.1 U4.1 U8.1 U19.3 U20.3 U21.3 U22.3 U23.3 U24.3 U25.3 U26.3 U27.3 U28.3 U29.3 U30.3 U31.3 U32.3 U33.3 U34.3 U35.8 U35.15 U36.8 U36.15 U37.5V U37.VIN U40.1 U41.1
GND: 3.3VEXT.1 5VEXT.1 C1.2 C2.2 C3.2 C4.2 CN10.2 CN11.2 CN12.2 CN14.2 CN15.2 CN16.2 CN17.2 CN18.2 CN19.2 CN20.2 CN21.2 CN56.2 CN57.2 CN58.2 CN59.2 CN60.2 CN61.2 CN62.2 CN63.2 CN64.2 CN65.2 CN66.2 CN67.2 CN68.2 CN69.2 CN70.2 CN71.2 CN72.1 CN73.1 CN74.1 CN75.1 CN76.1 CN77.1 CN78.1 CN79.1 CN80.1 CN81.1 CN82.1 CN83.1 CN84.1 CN85.1 CN86.1 CN87.1 CR2032.2 CUSTOM.1 ETHERNET.8 ETHERNET.9 GND.1 GND.2 GND.3 GND.4 H18.1 H18.3 HOSTUSB.4 HOSTUSB.5 HOSTUSB.6 I2C1-A0.3 I2C1-A1.3 I2C1-A2.3 I2C2-A0.3 I2C2-A1.3 I2C2-A2.3 I2CX-A0.3 I2CX-A1.3 I2CX-A2.3 LED1.2 LED2.2 LED3.2 LED4.2 LED5.2 LED6.2 LED7.2 LED8.2 LED9.2 LED10.2 LED11.2 LED12.2 LED13.2 LED14.2 LED15.2 LED16.2 PWM-A0.3 PWM-A1.3 PWM-A2.3 PWM-A3.3 PWM-A4.3 PWM-A5.3 SONAR0.2 SONAR1.2 SONAR2.2 SONAR3.2 U2.12 U4.2 U5.2 U6.2 U8.2 U16.12 U17.12 U18.14 U18.25 U35.9 U36.9 U37.GND1 U37.GND2 U37.GND3 U37.GND4 U37.GND5 U37.USB_GND1 U37.USB_GND2 U39.7 U39.8 U40.2 U41.2 U42.2

Pads without a net: ETHERNET 7 11 12 13 14; H19 4; H20 4; U12 3; U13 3; U14 3; U15 3; U35 1 3 14 16; U36 1 3 14 16; U37 VUSB

## Via types
v1: diameter 0.61, hole 0.305, Top Layer to Bottom Layer, 229 vias

## Routing (per net, layer and track width the routed paths; a pad name or vN(x,y) marks a point on that pad's centre or on a via; arc(x,y) is an arc through that point)
3.3V: length 727.2
  Top Layer w0.254: 97.03,102.28 94.74,100 88.99,100 87.98,101.01 ; 97.03,102.28 97.03,104.16 97.79,104.92 101.09,104.92 102.36,103.65 102.62,103.65 ; 97.03,102.28 97.03,100.76 99.31,98.47 102.87,98.47 ; 44.9,114.1 51.62,114.1 51.78,113.94 v1(51.78,113.2) ; R50.1 102.24,126.66 102.24,124.67 R41.1 102.24,123.14 102.24,121.15 R40.1 101.98,119.38 101.98,116.39 R39.1 R8.1 103,110.42 ; 128.78,118.15 130.05,116.88 140.97,116.88 142.24,118.15 ; 128.78,118.15 128.02,117.39 R49.2 128.78,116.12 128.78,114.39 127.03,112.64 127.03,109.09 ; 128.78,118.15 128.78,119.63 R48.2 128.02,121.15 127.25,121.91 127.25,122.93 ; R37.1 86.49,124.67 86.49,126.44 86.23,126.7 85.72,126.7 ; 37.81,110.66 39.08,110.66 40.1,109.65 v1(43.91,109.65) 44.41,109.65 U17.24 ; 37.81,110.66 R17.2 37.76,114.26 R52.2 R53.2 30.72,123.62 U37.3.3V_2 ; 37.81,110.66 37.81,108.56 R18.2 ; 142.24,118.15 142.38,118.15 R43.2 R9.2 144.53,109.83 144.53,107.85 R10.2 144.53,106.32 144.53,105.05 145.29,104.29 145.9,104.29 146.05,104.14 146.05,102.83 R11.2 R12.2 ; 142.24,118.15 144.4,120.31 R42.2 146.05,121.07 146.05,123.1 R44.2 144.53,124.62 144.53,126.66 R45.2 ; 49.7,99.03 RN2.1 RN1.4 RN1.3 RN1.2 RN1.1 43.91,99.88 43.91,102.03 44.16,102.28 ; 49.7,99.03 49.7,77.41 U36.2 v1(49.63,74.79) ; 49.7,99.03 RN2.2 RN2.3 RN2.4 ; 103,110.42 115.68,110.42 U2.24 125.32,107.63 126.78,109.09 127.03,109.09 ; 103,110.42 102.24,109.65 102.24,107.88 R7.1 102.11,106.22 102.11,104.16 102.62,103.65 ; v1(101.85,70.53) 101.85,86.28 v1(101.6,86.53) ; 127.54,109.09 127.03,108.58 127.03,106.41 R14.2 128.65,104.79 128.65,102.78 R15.2 R16.2 ; 127.54,109.09 127.03,109.09 ; 127.54,109.09 R13.2 ; 102.62,103.65 R6.1 ; v1(24.43,72) 25.19,71.24 26.71,71.24 28.24,72.76 v1(37.89,72.76) 37.89,71.71 U35.2 ; U42.1 U6.1 U5.1 104.71,30.66 U39.16 104.45,33.57 103.38,34.65 103.38,35.04 CN10.1 v1(83.06,42.91) ; 85.72,126.7 85.22,126.7 84.46,125.94 84.46,125.17 ; 85.72,126.7 R38.1 ; 84.95,109.72 84.95,109.82 R4.1 85.71,115.35 R35.1 86.49,116.13 86.49,119.63 R36.1 84.46,121.66 84.46,125.17 ; 84.95,109.72 84.95,107.43 R3.1 84.95,105.91 84.95,104.04 R2.1 87.98,101.01 ; 84.95,109.72 84.18,110.48 73.77,110.48 I2C1-A2.1 I2C1-A1.1 I2C1-A0.1 v1(62.01,109.65) ; R46.2 128.78,126.66 128.78,124.67 R47.2 127.25,123.14 127.25,122.93 ; 103,98.67 102.87,98.55 102.87,98.47 ; v1(155.1,40.18) CN57.1 CN56.1 ; 87.98,101.01 87.98,100.78 R1.1 ; 84.46,125.17 83.69,124.41 v1(74.95,124.41) ; v1(111.76,57.44) 112.2,57.44 112.36,57.6 ; 102.87,98.47 v1(102.87,93.9) ; 127.25,122.93 125.91,124.27 U16.24 ; 44.16,102.28 v1(44.67,102.28) ; 44.16,102.28 41.92,102.28 R51.2
  Inner2 w0.254: v1(155.1,40.18) CN58.1 CN59.1 CN60.1 CN61.1 CN62.1 125.86,40.55 117.6,48.81 116.84,48.81 ; 116.84,48.81 116.84,49.57 111.76,54.65 v1(111.76,57.44) 112.01,57.69 112.01,58.2 111.51,58.71 107.31,58.71 106.68,58.08 ; 116.84,48.81 116.84,42.33 CN63.1 ; 95.75,54.6 PWM-A2.1 PWM-A1.1 PWM-A0.1 ; 106.68,58.08 101.85,62.91 v1(101.85,70.53) ; 106.68,58.08 105.16,56.56 PWM-A5.1 PWM-A4.1 99.69,57.07 97.49,57.07 PWM-A3.1 95.76,55.34 95.76,43.17 CN10.1 ; U37.3.3V_1 11.81,92.12 v1(11.81,88.56) ; v1(63.69,35.04) 65.47,36.82 67.5,36.82 73.09,42.4 CN11.1 CN12.1 v1(83.06,42.91) ; v1(62.01,109.65) I2C1-PWR.1 56.61,113.2 v1(51.78,113.2) ; v1(37.89,72.76) 38.4,72.25 47.09,72.25 v1(49.63,74.79)
  Bottom Layer w0.254: v1(24.43,72) 24.43,74.43 U37.3.3V_3 15.88,84.5 v1(11.81,88.56) ; v1(51.78,113.2) 47.97,113.2 44.42,109.65 v1(43.91,109.65) 43.15,108.89 43.15,103.81 v1(44.67,102.28) ; 3.3V.1 3.3V.2 3.3V.3 3.3V.4 38.95,10.3 v1(63.69,35.04) ; I2CX-A0.1 I2CX-A1.1 I2CX-A2.1 52.96,126.54 I2C2-PWR.1 I2C2-A0.1 66.64,126.47 I2C2-A1.1 69.8,126.43 I2C2-A2.1 v1(74.95,124.41) ; v1(102.87,93.9) 102.87,87.8 v1(101.6,86.53) ; v1(83.06,42.91) CN12.1
3.3VEXT: length 241.9
  Top Layer w0.254: 62.74,80.7 63.75,79.68 68.46,79.68 69.72,80.94 70.99,79.67 75.33,79.67 77.87,82.22 v1(79.65,82.22) ; 62.74,80.7 62.74,80.94 60.2,83.48 v1(60.2,98.98) ; 62.74,80.7 61.59,79.56 61.59,25.46 C1.1 63.28,22.25 3.3VEXT.2 ; v1(61.14,105.38) 61.39,105.63 61.39,120.19 I2C2-PWR.3
  Inner2 w0.254: 103.89,79.93 102.87,78.91 102.87,76.63 100.08,73.83 97.54,73.83 96.01,75.36 96.01,80.94 ; 103.89,79.93 103.89,80.72 104.11,80.94 ; 103.89,79.93 104.39,79.93 v1(104.65,79.67) ; 96.01,80.94 97.27,80.94 ; 96.01,80.94 94.74,80.94 93.47,82.22 91.69,82.22 90.42,80.94 87.87,80.94 86.6,82.22 84.82,82.22 83.55,80.94 82.28,82.22 v1(79.65,82.22)
  Bottom Layer w0.254: v1(61.14,105.38) 60.33,104.57 I2C1-PWR.3 60.2,104.53 v1(60.2,98.98) ; v1(104.65,79.67) 109.71,79.67 112.25,82.22 114.03,82.22 115.3,80.94 117.86,80.94 119.13,82.22 120.9,82.22 122.17,80.94 124.68,80.94 125.95,82.22 130.38,82.22 131.65,80.94 132.92,82.22 137.25,82.22 138.53,80.94 139.79,82.22 144.02,82.22 145.29,80.94 146.43,82.09 151.1,82.09 U32.1 153.38,79.8 157.69,79.8 U33.1 160.23,82.34 164.56,82.34 U34.1
5VEXT: length 446.8
  Top Layer w0.254: v1(86.96,13.85) 86.2,13.09 5VEXT.2 78.84,22.25 C2.1 75.88,24.69 62.17,38.41 62.17,48.57 v1(62.42,48.82) ; U36.8 45.73,76.26 49.63,72.36 U36.15 49.53,71.5 v1(49.53,67.93) ; HOSTUSB.1 28.33,54.85 SONAR2.1 43.28,69.81 v1(43.28,69.96) 43.28,70.22 U35.8 41.9,72.36 38,76.26 U35.15 38,81.65 37.24,82.41 37.24,88.26 v1(37.49,88.51) ; v1(77.36,79.42) 76.6,78.66 U21.3 75.33,77.14 71.75,77.14 70.48,78.41 U20.3 67.06,78.41 65.79,77.14 v1(63.25,77.14) ; 13.84,122.35 14.67,123.18 25.02,123.18 ; U37.VIN 25.02,127.68 25.02,123.18 ; 25.02,123.18 25.53,122.67 25.78,122.67 27.05,121.4 27.05,107.68 v1(26.8,107.43)
  Inner2 w0.254: 89.39,76.63 v1(89.14,76.88) ; 89.39,76.63 86.85,74.09 86.09,74.09 84.82,75.36 84.82,77.14 U22.3 80.91,78.41 79.65,79.67 77.61,79.67 v1(77.36,79.42) ; 89.39,76.63 90.42,77.66 U23.3 ; SONAR0.1 SONAR1.1 50.73,90.41 U19.3 62.74,77.64 v1(63.25,77.14) ; SONAR0.1 38.99,95.24 v1(26.8,107.43) ; SONAR0.1 37.49,88.91 v1(37.49,88.51) ; 47.75,65.9 49.53,67.68 v1(49.53,67.93) ; 47.75,65.9 43.69,69.96 v1(43.28,69.96) ; 47.75,65.9 SONAR3.1 62.42,50.21 v1(62.42,48.82) ; v1(86.96,13.85) 86.96,13.59 90.76,9.8 U8.1 U4.1 U41.1 U40.1
  Bottom Layer w0.254: U34.3 164.56,79.8 160.23,79.8 U33.3 157.69,77.26 153.38,77.26 U32.3 149.48,78.53 148.46,79.55 146.43,79.55 U31.3 144.02,79.67 139.79,79.67 U30.3 137.25,79.67 132.92,79.67 131.65,78.41 130.38,79.67 125.95,79.67 U28.3 123.41,79.67 119.13,79.67 U27.3 116.59,79.67 112.25,79.67 U26.3 109.71,77.14 105.38,77.14 U25.3 100.3,82.22 99.3,82.22 98.54,81.45 98.54,79.67 U24.3 96,77.14 89.39,77.14 v1(89.14,76.88)
GND: length 1170.7
  Top Layer w0.254: 45.51,71.6 45.51,73.73 U35.9 41.9,83.18 40.12,84.95 40.12,85.97 ; 45.51,71.6 U36.9 ; 45.51,71.6 44.69,70.78 v1(44.69,67.99) ; CN56.2 CN57.2 CN58.2 CN59.2 CN60.2 CN61.2 CN62.2 120.77,37.64 ; 64.36,92.13 64.36,92.23 60.81,95.78 v1(60.81,98.07) ; 64.36,92.13 70.72,92.13 LED1.2 71.71,92.67 76.98,92.67 LED3.2 LED4.2 LED5.2 LED6.2 99.76,93.17 104.3,93.17 LED7.2 LED8.2 ; 64.36,92.13 LED2.2 ; 58.29,13.24 3.3VEXT.1 49.4,13.09 CR2032.2 19.3,5.6 GND.4 GND.3 GND.2 GND.1 ; 58.29,13.24 59.82,11.72 72.46,11.72 5VEXT.1 75.61,14.86 ; 58.29,13.24 58.29,13.75 60.83,16.29 C1.2 ; 75.61,14.86 76.39,15.65 C2.2 ; 75.61,14.86 75.61,14.36 78.4,11.56 87.86,11.56 90.91,14.61 ; 112.33,100.29 112.33,100.39 U2.12 ; 112.33,100.29 113.09,100.29 v1(115.12,102.32) ; 112.33,100.29 LED8.2 ; v1(49.02,98.07) 49.02,89.69 SONAR1.2 45.3,85.97 40.12,85.97 ; 15.92,47.85 HOSTUSB.4 ; 15.92,47.85 15.92,45.96 HOSTUSB.6 ; 15.92,47.85 13.91,49.86 HOSTUSB.5 v1(13.91,61.83) ; CN11.2 73.09,40.23 76.71,36.61 ; LED16.2 163.75,95.21 163.61,95.21 ; 40.12,85.97 40.12,86.78 SONAR0.2 33.76,93.14 U37.GND2 18.42,85.52 U37.GND4 17.65,82.22 v1(17.65,68.75) ; LED8.2 LED9.2 v1(122.98,91.9) 125.27,94.19 130.6,94.19 LED11.2 LED12.2 LED13.2 LED14.2 153.46,92.16 154.48,93.17 159.03,93.17 LED15.2 163.1,94.7 ; v1(95.06,51.48) PWM-A3.3 100.65,51.48 109.54,42.59 110.05,42.59 U39.8 U39.7 115.44,41.19 CN63.2 120.77,37.64 ; 163.61,95.21 164.41,96.01 C4.2 ; 163.61,95.21 163.1,94.7 ; LED10.2 125.89,91.65 v1(125.27,91.65) ; U16.12 112.59,117.08 v1(112.59,116.54) ; v1(49.01,61.39) 59.42,71.8 v1(60.94,71.8) ; 90.91,14.61 91.95,15.65 C3.2 76.71,36.61 ; 90.91,14.61 93.96,11.56 99.54,11.56 107.67,19.69 113.22,19.69 ; v1(88.6,50.97) 88.24,51.33 87.44,51.33 ; 113.22,19.69 U5.2 ; 113.22,19.69 120.46,19.69 ; 113.22,19.69 113.26,19.69 ; 76.71,36.61 76.71,36.79 CN12.2 82.36,42.44 82.36,43.21 87.18,48.03 87.18,51.08 87.44,51.33 ; 120.77,37.64 120.77,51.16 U18.14 ; v1(114.31,56.17) U18.25 ; 163.1,94.7 162.59,94.7 159,98.29 ETHERNET.8 159.26,101.01 161.54,103.3 161.54,105.08 169.67,113.2 169.67,114.88 ETHERNET.9 ; 87.44,51.33 PWM-A0.3 ; U17.12 52.17,102.99 v1(52.17,102.9) ; U40.2 U41.2 U4.2 U8.2 137.86,19.69 U42.2 U6.2
  Inner2 w0.254: 117.61,67.6 117.61,66.58 117.36,66.33 117.36,55.92 117,55.56 114.92,55.56 v1(114.31,56.17) ; 117.61,67.6 117.61,68.11 117.36,68.36 117.36,69.91 CN80.1 ; 117.61,67.6 117.87,67.34 121.66,67.34 CN81.1 126.75,71.17 v1(127.76,70.15) ; v1(74.68,72.69) 76.2,71.17 CN74.1 CN75.1 86.61,68.88 89.92,68.88 ; 21.72,121.84 17.65,121.84 U37.GND1 ; 21.72,121.84 U37.GND3 28.96,123.24 I2CX-A0.3 I2CX-A1.3 I2CX-A2.3 51.69,122.73 65.37,122.73 66.58,121.52 ; 21.72,121.84 18.67,118.79 18.67,115.37 ; 66.58,121.52 I2C2-A0.3 ; 66.58,121.52 66.71,121.65 69.5,121.65 I2C2-A1.3 69.8,121.35 I2C2-A2.3 79.16,121.35 CN64.2 CN65.2 CN66.2 CN67.2 106.81,122.32 v1(112.59,116.54) ; v1(78.68,104.06) CN14.2 CN15.2 ; 63.48,69.26 63.48,67.99 64.25,67.23 65.19,67.23 v1(69.33,71.36) ; 63.48,69.26 v1(60.94,71.8) ; 63.48,69.26 63.48,69.88 CN72.1 ; v1(107.44,71.17) CN78.1 CN77.1 94.23,67.36 90.68,67.36 89.92,68.12 89.92,68.88 ; v1(125.27,91.65) 125.01,91.9 v1(122.98,91.9) ; 45.7,62.91 39.1,62.91 SONAR2.2 ; 45.7,62.91 46.21,62.91 47.74,61.39 v1(49.01,61.39) ; 45.7,62.91 45.7,66.97 v1(44.69,67.99) ; 18.67,115.37 19.43,114.61 20.7,114.61 21.58,113.73 ; 18.67,115.37 14.49,115.37 13.84,114.73 U37.USB_GND2 ; 111.82,106.13 112.59,106.89 v1(112.59,116.54) ; 111.82,106.13 111.31,105.62 107.36,105.62 CN17.2 CN16.2 ; 111.82,106.13 115.12,102.83 v1(115.12,102.32) 119.01,106.2 CN18.2 CN19.2 CN20.2 CN21.2 ; CN10.2 94.3,41.62 94.3,50.72 v1(95.06,51.48) PWM-A2.3 PWM-A1.3 90.07,50.97 v1(88.6,50.97) ; v1(112.59,116.54) 119,122.96 CN68.2 CN69.2 CN70.2 CN71.2 ; 89.92,68.88 89.92,69.9 CN76.1 ; v1(17.65,68.75) 16.38,68.75 H18.3 H18.1 13.21,62.53 v1(13.91,61.83)
  Bottom Layer w0.254: 144.78,71.17 CN84.1 ; 144.78,71.17 144.78,68.12 145.54,67.36 149.1,67.36 CN85.1 CN86.1 CN87.1 ; 144.78,71.17 143.51,71.17 139.7,67.36 138.68,67.36 137.92,68.12 137.92,71.17 ; 103.25,51.48 PWM-A5.3 ; 103.25,51.48 107.31,47.42 117.98,47.42 119,48.43 119,50.21 117.47,51.73 ; 103.25,51.48 PWM-A4.3 PWM-A3.3 v1(95.06,51.48) ; v1(49.02,98.07) 48.77,98.32 48.77,101.88 49.78,102.9 v1(52.17,102.9) 55.22,102.9 59.79,98.32 60.55,98.32 ; v1(69.33,71.36) 69.58,71.11 CN73.1 72.18,72.69 v1(74.68,72.69) ; v1(78.68,104.06) 73.44,104.06 I2C1-A2.3 I2C1-A1.3 I2C1-A0.3 66.58,104.35 60.55,98.32 ; v1(114.31,56.17) 114.31,54.9 117.47,51.73 ; 109.73,70.15 108.46,70.15 v1(107.44,71.17) ; 109.73,70.15 110.74,70.15 CN79.1 ; 109.73,70.15 109.73,69.64 110.24,69.13 110.24,65.32 120.01,55.55 120.01,54.02 117.73,51.73 117.47,51.73 ; 60.55,98.32 v1(60.81,98.07) ; v1(49.01,61.39) 48.75,61.39 SONAR3.2 ; v1(127.76,70.15) 131.32,70.15 CN82.1 137.92,71.17 ; 137.92,71.17 CN83.1
A0: length 102.7
  Top Layer w0.254: v1(89.28,41.32) 89.53,41.57 96.01,41.57 v1(96.65,40.94) ; v1(99.19,41.19) U39.10
  Bottom Layer w0.254: v1(89.28,41.32) 88.52,41.32 85.22,44.62 81.41,44.62 39.5,86.53 37.72,86.53 U37.14 ; v1(99.19,41.19) 98.93,40.94 v1(96.65,40.94)
A1: length 104.9
  Top Layer w0.254: U39.11 99.57,39.92 97.92,41.57 97.92,42.59 96.39,44.12 90.81,44.12 v1(90.3,43.61)
  Bottom Layer w0.254: v1(90.3,43.61) 87,43.61 85.47,45.13 83.44,45.13 39.5,89.07 37.72,89.07 U37.15
A17: length 98.6
  Top Layer w0.254: v1(64.14,52.5) 77.34,52.5 v1(83.95,45.89) ; U39.9 102.55,44.62 v1(87,44.62)
  Bottom Layer w0.254: v1(83.95,45.89) 85.72,45.89 v1(87,44.62) ; U37.41 v1(64.14,52.5)
ANALOG: length 106.7
  Top Layer w0.254: v1(78.1,37) 78.61,36.5 98.43,36.5 v1(99.06,35.86) ; U39.3 109.22,36.11 v1(108.46,35.35)
  Inner2 w0.254: v1(99.06,35.86) 99.57,35.35 v1(108.46,35.35)
  Bottom Layer w0.254: U37.40 26.54,88.06 71.75,42.84 71.75,42.08 72.26,41.57 73.53,41.57 v1(78.1,37)
ANALOG-EN: length 96.4
  Top Layer w0.254: v1(71.15,76.7) 70.9,76.45 70.9,73.66 77.25,67.31 78.01,67.31 86.14,59.18 86.14,53.59 86.9,52.83 87.66,52.83 89.44,51.05 89.44,50.8 95.03,45.21 103.66,45.21 108.95,39.92 U39.6 ; U17.11 50.93,102.56 51.59,101.9 RN2.5 52.1,100.83 v1(52.36,100.58)
  Bottom Layer w0.254: v1(71.15,76.7) 70.9,76.96 70.9,78.99 70.14,79.75 68.61,79.75 68.36,80.01 68.36,84.83 52.61,100.58 v1(52.36,100.58)
BCLK2: length 106.8
  Top Layer w0.254: v1(63.63,66.72) 63.37,66.47 63.37,41.57 66.93,38.02
  Inner2 w0.254: v1(63.63,66.72) 62.86,67.48 62.86,69.01 47.88,83.99 45.34,83.99 42.8,86.53 36.7,86.53 26.54,96.69 26.03,96.69 12.83,109.9 12.83,113.97 U37.4
CRX1: length 112.4
  Inner2 w0.254: CN10.3 90.93,42.48 90.93,44.01 68.83,66.11 v1(68.83,69.92)
  Bottom Layer w0.254: U37.23 26.03,120.08 64.01,82.11 64.01,75.5 63.75,75.25 63.75,74.49 64.01,74.23 64.52,74.23 v1(68.83,69.92)
CS: length 85.6
  Inner2 w0.254: v1(42.29,70.28) 42.29,66.72 39.75,64.18 38.48,64.18 37.72,63.42 37.72,62.66 38.73,61.64 39.5,61.64 56.77,44.37 56.77,41.84 H20.2
  Bottom Layer w0.254: v1(42.29,70.28) 42.29,70.78 26.54,86.53 25.02,86.53 U37.10
CTX1: length 124.1
  Inner2 w0.254: U37.22 25.91,118.41 25.02,118.41 22.48,115.87 22.48,113.08 25.78,109.77 35.81,109.77 62.23,83.36 64.52,83.36 67.06,80.82 67.06,76.81 71.88,71.99 71.88,65.13 91.44,45.57 91.44,42.78 95,39.22 95.76,39.22 96.77,38.21 96.77,37.44 95.5,36.17 CN10.4
CUST: length 186.7
  Top Layer w0.254: CUSTOM.2 94.39,22.25 C3.1 96.77,29.52 v1(96.77,35.87) ; v1(78.47,74.59) 77.87,74.59 U21.5 75.33,74.59 v1(71.52,74.59)
  Inner2 w0.254: v1(98.55,56.44) 98.55,37.65 v1(96.77,35.87) ; U19.5 63.75,74.85 v1(64.39,74.85)
  Bottom Layer w0.254: v1(98.55,56.44) 98.55,63.56 92.96,69.14 92.96,73.46 92.46,73.97 92.46,74.48 ; U34.5 164.31,74.47 160.48,74.47 U33.5 157.43,74.47 153.64,74.47 U32.5 151.1,77.01 146.43,77.01 U31.5 144.02,77.14 139.79,77.14 U30.5 137.25,77.14 132.92,77.14 131.65,75.86 130.38,77.14 125.95,77.14 U28.5 123.41,77.14 119.13,77.14 U27.5 116.59,77.14 112.22,77.14 110.95,75.86 ; 92.46,74.48 91.07,75.86 U23.5 87.88,75.86 86.61,77.14 84.82,77.14 U22.5 82.28,74.59 v1(78.47,74.59) ; 92.46,74.48 95.76,74.48 97.03,75.75 97.15,75.75 98.42,77.02 101.72,77.02 102.74,76 103.97,76 105.24,74.73 109.81,74.73 110.95,75.86 ; v1(71.52,74.59) 70.99,74.59 U20.5 68.45,74.59 64.9,74.59 64.64,74.85 v1(64.39,74.85) ; 110.95,75.86 U26.5
ECHO0: length 32.5
  Top Layer w0.254: U35.7 41.25,72.36 39.22,74.4 20.67,74.4 v1(19.91,75.16)
  Bottom Layer w0.254: v1(19.91,75.16) 10.99,75.16 U37.30
ECHO1: length 30.9
  Top Layer w0.254: U35.5 39.95,70.84 38.42,69.32 19.38,69.32 v1(18.87,69.82)
  Bottom Layer w0.254: v1(18.87,69.82) 11.25,69.82 U37.32
ECHO2: length 26.9
  Top Layer w0.254: v1(44.09,77.08) 45.62,78.6 45.87,78.6 46.38,78.1 U36.7
  Inner2 w0.254: v1(44.09,77.08) 43.33,76.32 25.55,76.32 25.05,75.81 25.05,73.81 U37.34
ECHO3: length 24.3
  Top Layer w0.254: U36.5 v1(47.68,79.37)
  Inner2 w0.254: v1(47.68,79.37) 46.21,77.9 U37.36
I2C1-RESET: length 76.1
  Top Layer w0.254: U2.3 v1(108.36,106.33) ; 44.86,100.75 44.86,101.25 46.38,102.78 U17.4 ; 44.86,100.75 RN1.8 ; 44.86,100.75 44.86,100.24 45.11,99.98 70,99.98 74.83,104.81 83.46,104.81 v1(84.23,105.57)
  Bottom Layer w0.254: v1(108.36,106.33) 107.34,107.35 106.32,107.35 105.31,106.33 99.72,106.33 98.7,107.35 89.05,107.35 87.27,105.57 v1(84.23,105.57)
I2C2-RESET: length 85
  Top Layer w0.254: U16.3 113.56,122.97 114.33,122.21 114.33,116.62 109.25,111.54 v1(104.67,111.54) ; RN1.7 45.55,101.08 47.03,102.56 U17.5 47.02,103.59 47.02,104.43 48.03,105.44 50.32,105.44 54.64,109.76 v1(54.64,111.03)
  Bottom Layer w0.254: v1(104.67,111.54) 104.42,111.29 54.89,111.29 v1(54.64,111.03)
IN2: length 39.2
  Top Layer w0.254: v1(18.16,109.77) 25.78,102.15 40,102.15 R51.1 44.08,103.92 U17.1
  Bottom Layer w0.254: v1(18.16,109.77) 14.49,109.77 U37.5
LRCLK2: length 165.6
  Top Layer w0.254: v1(125.81,14.14) U42.5
  Bottom Layer w0.254: v1(125.81,14.14) 121.49,18.46 117.22,18.46 114.68,21 108.08,21 85.47,43.61 81.66,43.61 49.66,75.61 48.13,75.61 39.75,83.99 38.73,83.99 37.72,85.01 37.72,85.52 26.54,96.69 26.03,96.69 25.02,97.71 25.02,105.08 14.35,115.74 13.59,115.74 U37.3
MISO: length 174.7
  Inner2 w0.254: v1(141.35,19.22) 141.1,18.97 131.44,18.97 129.41,21 106.04,21 55.75,71.29 v1(36.7,71.29)
  Bottom Layer w0.254: v1(141.35,19.22) 143.33,19.22 U8.4 U4.4 ; v1(36.7,71.29) 26.54,81.45 26.03,81.45 25.02,82.47 25.02,82.98 12.32,95.68 U37.12
MISO1: length 169.4
  Top Layer w0.254: v1(156.59,20.49) 156.65,20.49 U41.4 U40.4
  Inner2 w0.254: v1(156.59,20.49) 156.08,21 130.94,21 128.65,23.29 104.78,23.29 48.02,80.04 31.51,80.04 U37.39
MOSI: length 178.2
  Bottom Layer w0.254: U37.11 25.02,83.99 27.56,83.99 45.34,66.21 45.34,65.2 46.36,64.18 48.13,64.18 72.01,40.31 72.01,39.8 72.77,39.03 73.53,39.03 99.04,13.53 143.98,13.53 U8.3 U4.3
MOSI1: length 191.7
  Inner2 w0.254: U37.26 14.86,85.52 17.4,82.98 17.4,79.93 26.03,71.29 26.54,71.29 38.73,59.1 39.5,59.1 56.26,42.34 56.26,40.56 57.53,39.29 58.55,39.29 78.87,18.97 91.06,18.97 v1(91.31,19.22)
  Bottom Layer w0.254: U40.3 U41.3 156.14,11.09 99.44,11.09 v1(91.31,19.22)
OUT1A: length 59.5
  Top Layer w0.254: 58.06,38.02 56.77,39.31 56.77,49.19 v1(57.78,50.21)
  Bottom Layer w0.254: v1(57.78,50.21) 57.78,51.48 47.62,61.64 46.86,61.64 46.1,62.4 46.1,62.91 U37.38
OUT1C: length 140.1
  Top Layer w0.254: v1(107.57,17.79) U5.5
  Bottom Layer w0.254: U37.9 25.02,89.07 26.54,89.07 71.5,44.12 74.04,44.12 79.12,39.03 86.33,39.03 v1(107.57,17.79)
OUT1D: length 89.7
  Bottom Layer w0.254: U37.6 9.27,109.39 9.27,93.14 10.8,91.61 11.3,91.61 19.94,82.98 19.94,82.47 26.03,76.37 26.54,76.37 37.72,65.2 37.72,62.66 38.73,61.64 39.51,61.64 H20.1
OUT2: length 172.6
  Top Layer w0.254: v1(60.83,69.01) v1(60.83,49.45)
  Inner2 w0.254: U6.5 118.68,10.41 v1(118.66,10.41)
  Bottom Layer w0.254: v1(118.66,10.41) 118.41,10.67 98.85,10.67 90.55,18.97 90.55,19.48 73.53,36.5 72.77,36.5 67.44,41.83 65.91,41.83 60.83,46.91 v1(60.83,49.45) ; U37.2 13.59,118.28 14.35,118.28 18.67,113.97 18.67,113.2 25.02,106.85 26.54,106.85 46.86,86.53 47.88,86.53 60.33,74.09 60.33,69.52 v1(60.83,69.01)
PWM-OE: length 92
  Top Layer w0.254: RN1.6 46.35,101.23 47.68,102.56 ; U17.6 47.68,102.56 ; 47.68,102.56 v1(47.68,102.31) ; v1(88.07,81.73) 88.07,80.97 89.34,79.7 93.4,79.7 95.94,77.16 95.94,75.38 104.07,67.25 106.86,67.25 115.5,58.62 115.5,57.71 U18.23
  Inner2 w0.254: v1(88.07,81.73) 86.8,83 70.03,83 64.44,88.59 61.4,88.59 v1(47.68,102.31)
RX1: length 166.2
  Bottom Layer w0.254: U37.0 9.78,125.14 9.78,112.95 10.8,111.93 11.3,111.93 24.51,98.72 24.51,95.42 25.78,94.15 26.54,94.15 37.72,82.98 37.72,82.47 78.61,41.57 84.71,41.57 107.82,18.46 113.66,18.46 114.94,17.19 U6.3
RX2: length 89.3
  Inner2 w0.254: v1(66.93,50.72) H19.1
  Bottom Layer w0.254: U37.7 25.02,94.15 25.02,92.63 26.03,91.61 27.31,91.61 66.93,51.99 v1(66.93,50.72)
RX5: length 147.4
  Bottom Layer w0.254: U42.3 121.67,23.29 119.25,23.29 98.43,44.12 96.14,44.12 89.53,50.72 89.53,50.97 87.76,52.75 86.74,52.75 72.26,67.23 70.23,67.23 69.47,67.99 69.47,68.25 65.41,72.31 64.64,72.31 61.59,75.36 61.59,82.98 28.58,116 U37.21
RX7: length 128.6
  Inner2 w0.254: U37.28 74.04,17.19 U5.3
SCK: length 157.9
  Top Layer w0.254: v1(143.29,21.76) U8.5 U4.5
  Inner2 w0.254: U37.13 37.72,83.99 44.58,83.99 48.13,80.44 48.39,80.44 105.03,23.79 128.91,23.79 130.94,21.76 v1(143.29,21.76)
SCK1: length 183.6
  Inner2 w0.254: U37.27 57.02,36.75 60.33,36.75 78.54,18.53 158.57,18.53 U41.5 U40.5
SCL: length 155.3
  Top Layer w0.254: 45.67,108.61 45.17,108.1 44.4,108.1 43.64,107.34 35.51,107.34 34.75,108.1 34.75,108.61 ; 45.67,108.61 47.71,106.57 v1(49.74,106.57) ; 45.67,108.61 45.67,109.56 U17.22 ; v1(31.96,109.11) 32.47,108.61 34.75,108.61 ; 34.75,108.61 36.25,110.1 R17.1 ; v1(114.24,106.33) U2.22 ; v1(113.41,58.91) 113.66,58.65 U18.26
  Inner2 w0.254: v1(113.66,83.04) 113.66,82.53 114.68,81.51 114.68,60.18 v1(113.41,58.91)
  Bottom Layer w0.254: v1(49.74,106.57) 50.49,105.83 60.65,105.83 63.19,108.37 73.35,108.37 74.11,107.6 86.3,107.6 88.59,109.89 107.64,109.89 111.19,106.33 v1(114.24,106.33) 115.26,106.33 115.76,105.83 115.76,85.14 v1(113.66,83.04) ; v1(31.96,109.11) 27.84,109.11 U37.19
SCL1: length 101.7
  Top Layer w0.254: U16.22 v1(116.31,122.97) ; v1(37,115.04) 37,115.02 36.27,114.28 26.03,104.05 U37.16
  Bottom Layer w0.254: v1(37,115.04) 37.71,114.33 107.67,114.33 v1(116.31,122.97)
SCL2: length 94.8
  Top Layer w0.254: CN11.3 71.82,36.64 66.48,36.64 v1(62.93,40.2)
  Inner2 w0.254: CN11.3 CN12.3
  Bottom Layer w0.254: v1(62.93,40.2) 61.4,41.72 57.13,41.72 39.6,59.25 38.59,59.25 27.16,70.68 27.16,73.22 26.14,74.23 25.63,74.23 17,82.87 17,84.39 U37.24
SDA: length 158.8
  Top Layer w0.254: U17.23 45.14,109.56 45.14,108.76 44.89,108.5 44.12,108.5 ; U18.27 113.01,56.64 114.74,54.91 v1(115.5,54.91) ; v1(114.74,106.98) 118.46,106.98 ; 44.12,108.5 v1(43.87,108.5) ; 44.12,108.5 43.87,108.76 39.3,108.76 38.28,107.74 37.01,107.74 R18.1 35.49,108.5 v1(35.36,108.38)
  Inner2 w0.254: v1(114.48,82.6) 116.14,80.94 116.14,56.81 v1(116.77,56.18) ; v1(35.36,108.38) U37.18
  Bottom Layer w0.254: v1(116.77,56.18) v1(115.5,54.91) ; v1(43.87,108.5) 44.89,108.5 46.16,107.23 58.6,107.23 59.87,108.5 62.67,108.5 64.95,110.79 107.37,110.79 111.18,106.98 v1(114.74,106.98) 115.24,106.98 116.26,105.96 116.26,84.37 v1(114.48,82.6)
SDA1: length 100.7
  Top Layer w0.254: v1(37.03,115.8) 36.52,116.31 ; 36.52,116.31 36.51,116.31 U37.17 ; 36.52,116.31 36.27,116.56 ; v1(115.29,123.11) 115.8,123.62 U16.23
  Bottom Layer w0.254: v1(115.29,123.11) 108.74,116.56 37.79,116.56 v1(37.03,115.8)
SDA2: length 93.7
  Inner2 w0.254: CN11.4 CN12.4
  Bottom Layer w0.254: CN11.4 69.28,39.22 55.56,39.22 20.51,74.27 20.51,75.54 14.41,81.64 14.41,84.44 U37.25
SPI0-SEL: length 138.9
  Top Layer w0.254: U17.7 48.33,102.01 RN1.5 47.92,100.83 v1(48.17,100.58)
  Inner2 w0.254: U8.6 145.21,22.35 142.77,22.35 126.26,38.86 125.13,38.86 117.51,46.48 v1(117.51,48) ; v1(105.57,58.16) 89.57,58.16 77.89,69.85 76.62,69.85 74.08,72.39 74.08,78.23 72.55,79.75 71.79,79.75 71.03,80.51 71.03,81.78 70.52,82.29 68.74,82.29 65.19,85.85 62.9,85.85 v1(48.17,100.58)
  Bottom Layer w0.254: v1(105.57,58.16) 107.35,58.16 v1(117.51,48)
SPI1-SEL: length 149.8
  Top Layer w0.254: 49.45,101.33 48.98,101.8 U17.8 ; 49.45,101.33 49.45,101.09 RN2.8 ; 49.45,101.33 v1(49.45,101.58)
  Inner2 w0.254: v1(113.96,62.64) 113.46,62.64 110.66,65.43 110.66,68.99 105.33,74.32 105.33,82.45 104.06,83.72 104.06,87.28 101.26,90.07 84.16,90.07 83.99,89.9 61.13,89.9 v1(49.45,101.58)
  Bottom Layer w0.254: v1(113.96,62.64) 138.35,38.25 138.35,37.24 139.36,36.22 140.13,36.22 152.53,23.82 U4.6
SPI2-SEL: length 155.2
  Top Layer w0.254: v1(50.25,101.65) 50.25,101.4 50.14,101.29 ; U17.9 49.63,102.31 50.14,101.8 50.14,101.29 ; 50.14,101.29 49.99,101.15 RN2.7
  Bottom Layer w0.254: v1(50.25,101.65) 52.28,101.65 69.81,84.13 69.81,83.62 71.33,82.1 72.85,82.1 75.39,79.56 75.39,66.35 86.57,55.17 87.84,55.17 89.62,53.39 89.62,53.14 90.13,52.63 91.14,52.63 92.67,51.11 92.67,50.85 106.64,36.88 107.91,36.88 120.86,23.93 149.31,23.93 152.1,21.14 158.68,21.14 U41.6
SPI3-SEL: length 163.4
  Top Layer w0.254: v1(59.42,100.78) 55.36,104.85 50.53,104.85 50.28,104.59 U17.10 50.28,102.56 51.04,101.8 51.04,101.54 50.79,101.3 RN2.6
  Inner2 w0.254: v1(59.42,100.78) 69.72,90.49 110.87,90.49 119.12,82.24 120.89,82.24 123.43,79.7 123.43,75.38 131.05,67.76 131.05,65.22 158.99,37.28 158.99,30.44 U40.6
TRIG0: length 31.8
  Top Layer w0.254: v1(19.77,72.62) 21.04,73.89 39.08,73.89 40.6,72.36 40.6,71.6
  Bottom Layer w0.254: U37.31 10.99,72.62 v1(19.77,72.62)
TRIG1: length 14.3
  Top Layer w0.254: 39.3,71.6 39.3,70.84 38.79,70.33 26.09,70.33 U37.33
TRIG2: length 22.4
  Top Layer w0.254: v1(46.78,76.06) 47.03,76.32 U36.6
  Inner2 w0.254: v1(46.78,76.06) 46.07,75.36 U37.35
TRIG3: length 25.6
  Top Layer w0.254: U36.4 48.33,79.62 47.82,80.13 46.05,80.13 v1(45.28,79.37)
  Inner2 w0.254: U37.37 26.85,79.62 45.03,79.62 v1(45.28,79.37)
TX1: length 181.8
  Inner2 w0.254: U6.4 119.23,15.92 74.7,15.92 11.7,78.91 10.8,78.91 9.78,79.93 9.78,122.6 U37.1
TX2: length 91.5
  Bottom Layer w0.254: H19.2 66.17,40.56 47.62,59.1 46.86,59.1 46.1,59.86 46.1,60.37 27.56,78.91 26.03,78.91 22.48,82.47 22.48,82.98 11.3,94.15 10.8,94.15 9.78,95.17 9.78,104.82 U37.8
TX5: length 148
  Bottom Layer w0.254: U37.20 28.58,113.46 61.09,80.94 61.09,72.56 63.88,69.77 65.15,69.77 94.36,40.56 94.36,39.8 95.12,39.03 100.97,39.03 119,21 121.45,21 U42.4
TX7: length 128.6
  Inner2 w0.254: U5.4 75.27,14.69 12.06,77.9 U37.29
$1N4291: length 157.2
  Inner2 w0.254: v1(33.3,110.42) 35.84,110.42 42.7,103.57 57.94,103.57 62.26,99.25 163.86,99.25 165.38,100.77 165.38,101.28 167.18,103.08 167.42,103.08 167.89,103.55
  Bottom Layer w0.254: v1(33.3,110.42) 28.98,114.74 20.6,114.74 19.58,113.73
$1N4303: length 154.2
  Inner2 w0.254: 19.58,115.73 23.39,119.54 65.81,119.54 73.43,111.92 v1(82.83,111.92)
  Bottom Layer w0.254: 165.35,103.55 164.1,104.81 154.97,104.81 147.6,112.17 83.09,112.17 v1(82.83,111.92)
$1N4309: length 10.5
  Top Layer w0.254: C4.1 165.97,100.44 ; 165.97,100.44 165.97,100.7 163.17,103.49 162.87,103.49 162.81,103.55 ; 165.97,100.44 166.53,101.01 ETHERNET.2
$1N4403: length 147.7
  Inner2 w0.254: 23.58,115.73 24.91,114.41 43.6,114.41 44.92,115.73 56.35,115.73 61.18,110.9 110.2,110.9 v1(111.72,109.38)
  Bottom Layer w0.254: v1(111.72,109.38) 114.77,109.38 121.81,102.34 162.75,102.34 ETHERNET.4
$1N4422: length 144.3
  Inner2 w0.254: 23.58,113.73 25.36,111.95 35.27,111.95 43.14,104.08 58.13,104.08 62.46,99.74 160.27,99.74 ETHERNET.6
$1N4449: length 152.5
  Inner2 w0.254: v1(24.38,120.3) 24.63,120.05 66.03,120.05 72.8,113.28 v1(111.91,113.28)
  Bottom Layer w0.254: 21.58,115.73 21.58,117.5 v1(24.38,120.3) ; v1(111.91,113.28) 155.35,113.28 156.62,112.01 165.96,112.01 ETHERNET.10
$1N4572: length 69
  Top Layer w0.254: 13.84,117.27 16.82,114.29 16.82,82.54 16.31,82.03 16.31,60.7 17.08,59.94 17.08,57.65 16.31,56.89 v1(16.31,55.87) ; v1(16.31,51.3) HOSTUSB.3
  Inner2 w0.254: v1(16.31,55.87) v1(16.31,51.3)
$1N4583: length 69.9
  Top Layer w0.254: 13.84,119.81 17.33,116.32 17.33,82.47 16.82,81.96 16.82,60.88 17.58,60.12 17.58,56.56 v1(17.08,56.05) ; v1(17.08,53.77) 17.08,53.12 HOSTUSB.2
  Bottom Layer w0.254: v1(17.08,56.05) v1(17.08,53.77)
$1N4741: length 75.8
  Top Layer w0.254: U37.VBAT 12.06,81.71 12.06,61.13 10.8,59.86 10.8,42.84 19.27,34.37 CR2032.1
$1N4831: length 25.2
  Top Layer w0.254: U37.PROGRAM 18.42,80.44 v1(18.42,70.53)
  Inner2 w0.254: H18.2 11.81,64.18 11.81,65.7 16.64,70.53 v1(18.42,70.53)
$1N4835: length 28.2
  Top Layer w0.254: v1(19.18,73.58) 19.18,78.66 U37.ON/OFF
  Bottom Layer w0.254: H18.4 11.81,64.44 14.35,64.44 20.7,70.78 20.7,72.82 19.94,73.58 v1(19.18,73.58)
$2N1400: length 39.4
  Top Layer w0.254: CN14.4 84.52,101.2 R1.2 ; v1(108.51,104.76) 109.44,105.68 U2.4
  Bottom Layer w0.254: CN14.4 82.09,102.47 107.24,102.47 108.51,103.74 v1(108.51,104.76)
$2N1404: length 40.8
  Top Layer w0.254: v1(104,105.54) 104,104.78 106.29,102.49 108.57,102.49 111.11,105.03 U2.5 ; CN14.3 83.78,103.7 85.71,101.78
  Inner2 w0.254: CN14.3 82.09,104.97 103.43,104.97 v1(104,105.54)
$2N1409: length 31
  Top Layer w0.254: R3.2 89.47,101.4 CN15.4 ; U2.6 112.28,104.25 111.32,104.25 108.02,100.95 v1(108.02,100.69)
  Bottom Layer w0.254: v1(108.02,100.69) 107.25,99.93 90.74,99.93 CN15.4
$2N1414: length 38.8
  Top Layer w0.254: v1(100.9,107.77) 100.65,107.51 93.28,107.51 CN15.3 89.47,104.46 85.71,108.23 R4.2 ; U2.7 113.38,103.73 113.6,103.95 113.6,108.02 113.1,108.53 v1(111.57,108.53)
  Inner2 w0.254: v1(111.57,108.53) 110.56,107.51 104.97,107.51 104.71,107.77 v1(100.9,107.77)
$2N1419: length 16.2
  Top Layer w0.254: 102.95,100.18 R5.2 ; 102.95,100.18 102.19,100.18 101.17,101.2 CN16.4 ; 102.95,100.18 103.21,99.93 108.28,99.93 111.44,103.08 U2.8
$2N1424: length 22.7
  Top Layer w0.254: v1(113.62,102.43) 112.42,102.43 ; R6.2 101.44,103.7 CN16.3
  Inner2 w0.254: v1(113.62,102.43) 99.4,102.43 CN16.3
$2N2020: length 10.6
  Top Layer w0.254: U2.14 120.55,101.13 CN18.3 123.29,103.52 R15.1
$2N2036: length 27.2
  Top Layer w0.254: U2.15 117.63,101.78 117.3,101.45 117.3,100.18 119.84,97.64 128.47,97.64 131.78,100.95 CN19.4 129.49,103.49 129.49,105.26 127.89,106.86 R14.1
$2N2050: length 22.5
  Top Layer w0.254: R13.1 128.73,109.75 128.73,106.75 CN19.3 ; v1(119.84,102.18) 119.58,102.43 U2.16
  Inner2 w0.254: CN19.3 130.51,102.43 120.09,102.43 v1(119.84,102.18)
$2N2062: length 36.7
  Top Layer w0.254: U2.17 117.68,103.08 116.81,102.22 116.81,99.93 119.61,97.14 136.37,97.14 CN20.4 142.65,101.2 R12.1
